# Altium project pcb_project.prjpcb (part 1 of 2)
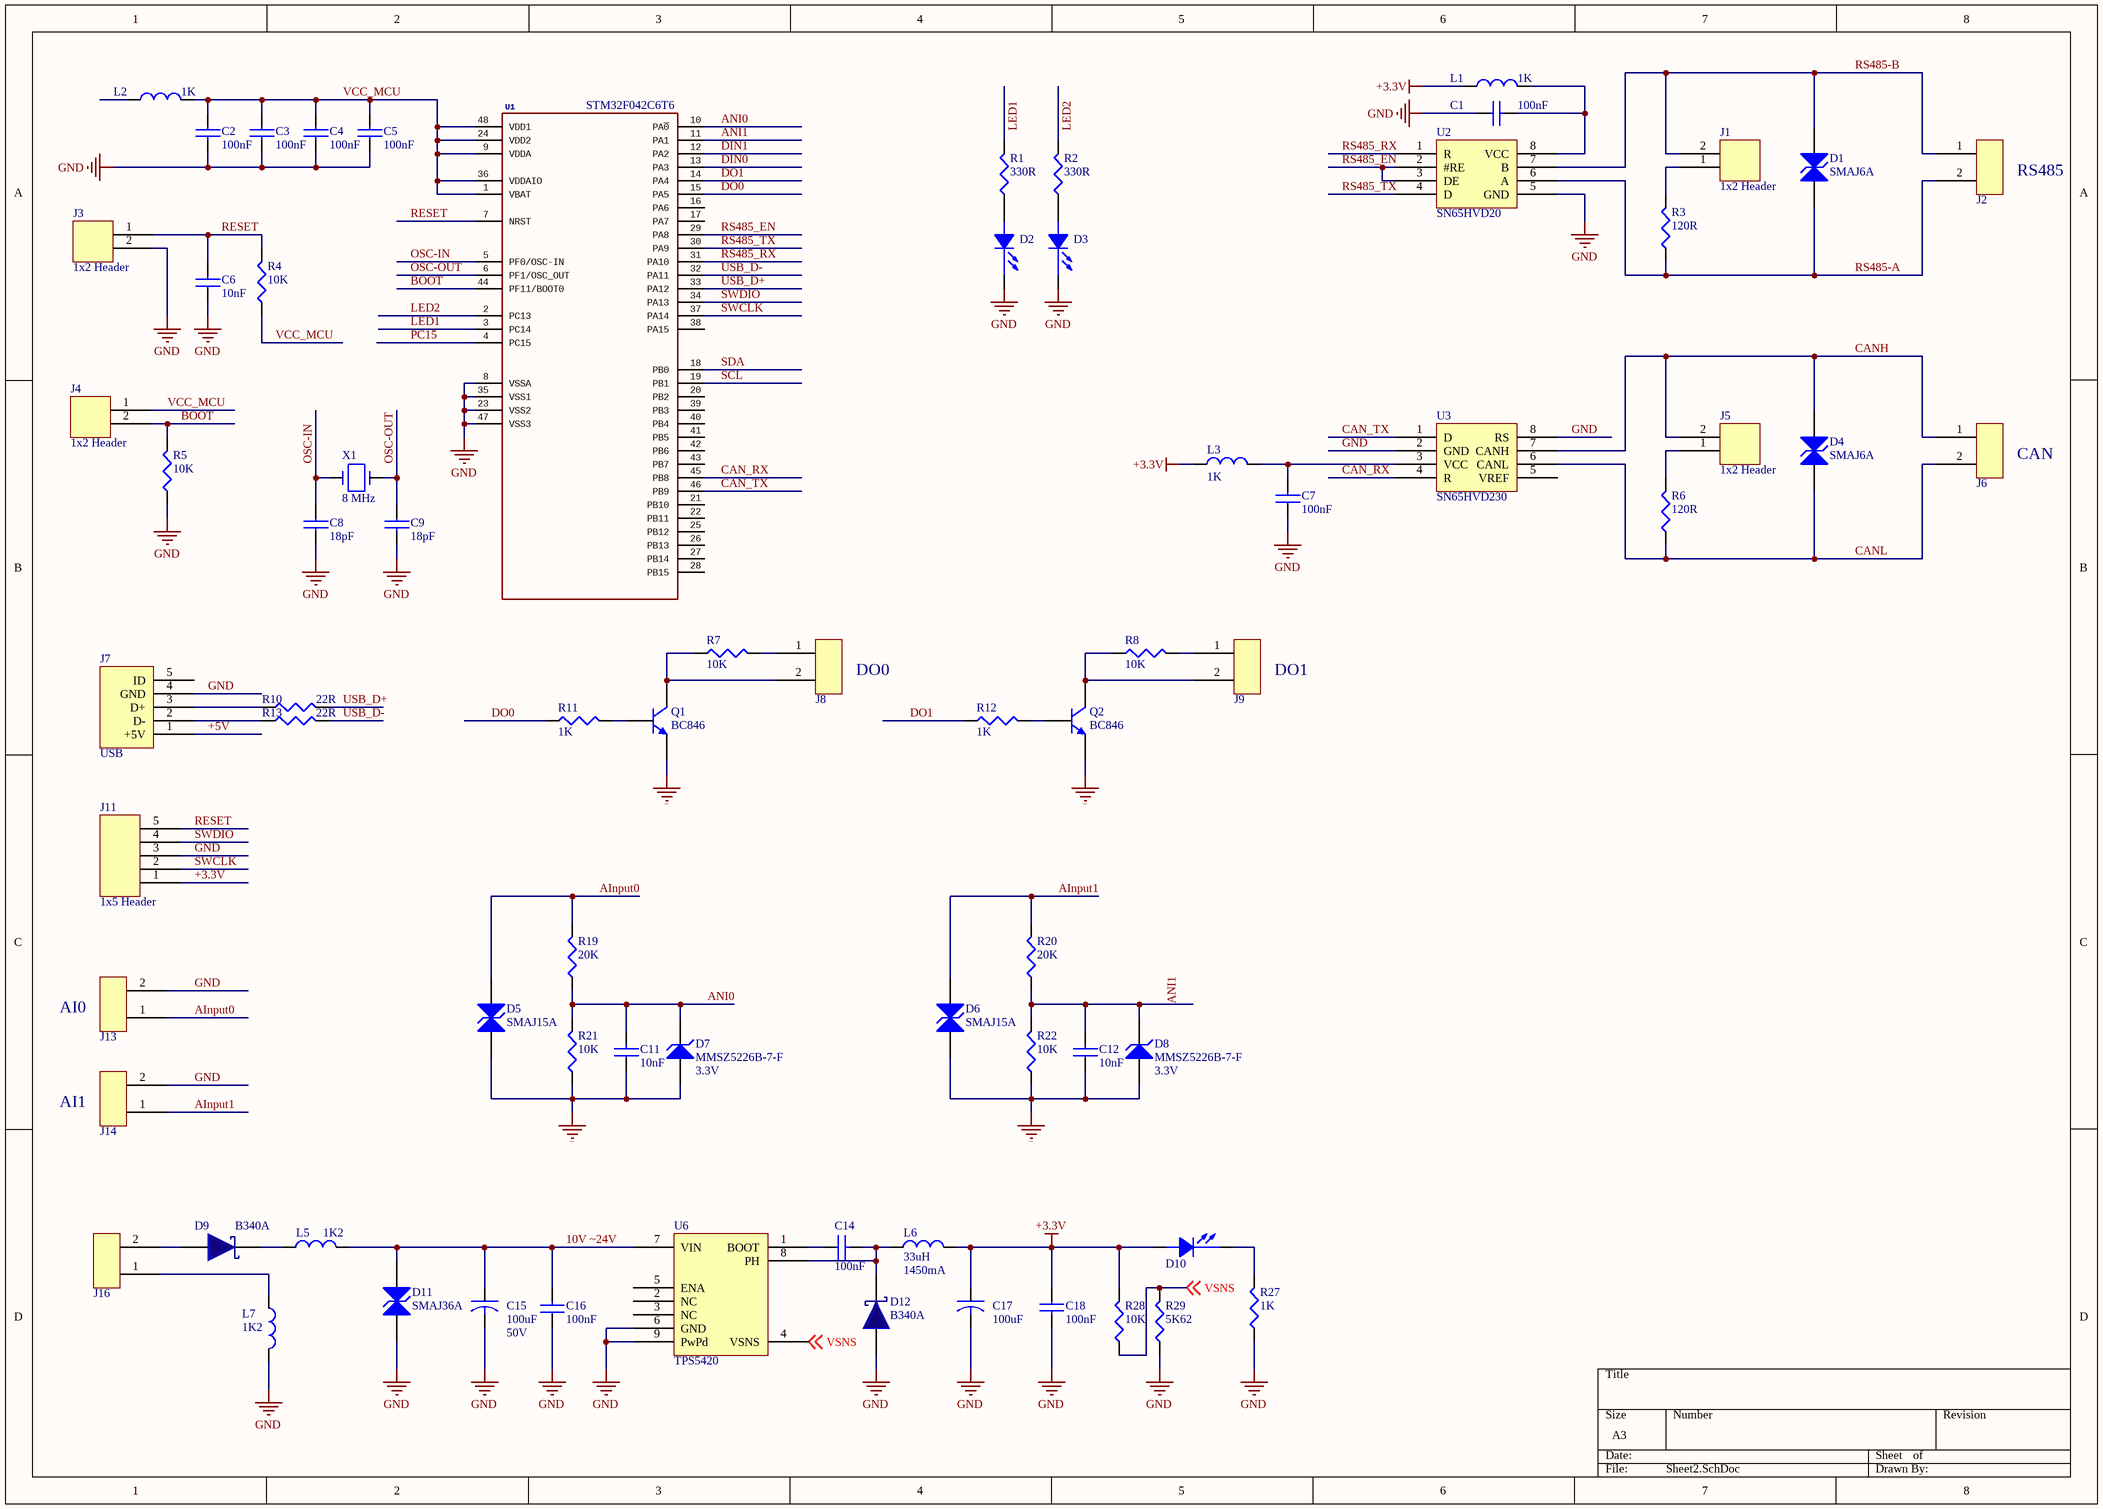
[diagram p0: Sheet2.SchDoc]
10 sheets, 305 parts. Net scope: flat (ports and power ports of the same name join across sheets).
Board file: PCB1.PcbDoc
Sheets:
  Sheet2.SchDoc
  Power.SchDoc
  opto_input.schdoc
  MCU.SchDoc
  Analog_Voltage_Outputs.SchDoc
  Analog Inputs.SchDoc
  Serial and Ethernet.SchDoc
  Resistive_Load_Output.SchDoc
  Analog_Current_Output.SchDoc
  Frequency_Output.SchDoc

## Sheet Sheet2.SchDoc
size A3; PageSetup: Record=PageOptions|CenterHorizontal=True|CenterVertical=True|PrintScale=1.00|XCorrection=1.00|YCorrection=1.00|PrintKind=1|BorderSize=5000000|LeftOffset=0|BottomOffset=0|Orientation=2|PaperLength=1000|PaperWidth=1000|Scale=100|PaperSource=7|PrintQuality=-3|MediaType=1|DitherType=10|PrintScaleMode=1|PaperKind=A3|PaperIndex=8

### Parts
(Parts that share a designator on the sheet are numbered #1, #2 ... from top to bottom, then left to right.)
C1  value 100nF  [0805 SMD Ceramic Capacitor]  (hidden comment: C0805C104)
C2  value 100nF  [0805 SMD Ceramic Capacitor]  (hidden comment: C0805C104)
C3  value 100nF  [0805 SMD Ceramic Capacitor]  (hidden comment: C0805C104)
C4  value 100nF  [0805 SMD Ceramic Capacitor]  (hidden comment: C0805C104)
C5  value 100nF  [0805 SMD Ceramic Capacitor]  (hidden comment: C0805C104)
C6  value 10nF  [0805 SMD Ceramic Capacitor]  (hidden comment: C0805C103)
C7  value 100nF  [0805 SMD Ceramic Capacitor]  (hidden comment: C0805C104)
C8  value 18pF  [0805 SMD Ceramic Capacitor]  (hidden comment: C0805C180)
C9  value 18pF  [0805 SMD Ceramic Capacitor]  (hidden comment: C0805C180)
C11  value 10nF  [0805 SMD Ceramic Capacitor]  (hidden comment: C0805C103)
C12  value 10nF  [0805 SMD Ceramic Capacitor]  (hidden comment: C0805C103)
C14  value 100nF  [0805 SMD Ceramic Capacitor]  (hidden comment: C0805C104)
C15  value 100uF  Voltage: 50V  [150CLZ1010]  (hidden comment: 100uF/50V Electrolitic)
C16  value 100nF  [0805 SMD Ceramic Capacitor]  (hidden comment: C0805C104)
C17  value 100uF  [D Case]  (hidden comment: T491D107)
C18  value 100nF  [0805 SMD Ceramic Capacitor]  (hidden comment: C0805C104)
D1  SMAJ6A  [SMA]
D2  LED  [1206]  (value not drawn)
D3  LED  [1206]  (value not drawn)
D4  SMAJ6A  [SMA]
D5  SMAJ15A  [SMA]
D6  SMAJ15A  [SMA]
D7  value 3.3V  [SOD-123]  (hidden comment: MMSZ5226B-7-F)
D8  value 3.3V  [SOD-123]  (hidden comment: MMSZ5226B-7-F)
D9  B340A  [SMB]
D10  LED  [1206]  (value not drawn)
D11  SMAJ36A  [SMA]
D12  B340A  [SMB]
J1  value 1x2 Header  [1x2 2 Pin Header]  (hidden comment: 1x2 2 Pin Header)
J2  2x Terminal  [2x Terminal mini]  (value not drawn)
J3  value 1x2 Header  [1x2 2 Pin Header]  (hidden comment: 1x2 2 Pin Header)
J4  value 1x2 Header  [1x2 2 Pin Header]  (hidden comment: 1x2 2 Pin Header)
J5  value 1x2 Header  [1x2 2 Pin Header]  (hidden comment: 1x2 2 Pin Header)
J6  2x Terminal  [2x Terminal mini]  (value not drawn)
J7  value USB  [Mini USB B]  (hidden comment: USB_B)
J8  2x Terminal  [2x Terminal mini]  (value not drawn)
J9  2x Terminal  [2x Terminal mini]  (value not drawn)
J11  value 1x5 Header  [1x5 5 Pin Header]  (hidden comment: 1x5 5 Pin Header)
J13  2x Terminal  [2x Terminal mini]  (value not drawn)
J14  2x Terminal  [2x Terminal mini]  (value not drawn)
J16  2x Terminal  [2x Terminal mini]  (value not drawn)
L1  value 1K  [0805 Inductor]  (hidden comment: 0805Ferrite)
L2  value 1K  [0805 Inductor]  (hidden comment: 0805Ferrite)
L3  value 1K  [0805 Inductor]  (hidden comment: 0805Ferrite)
L5  value 1K2  [1206 Inductor]  (hidden comment: 1206Ferrite)
L6  value 33uH  Current: 1450mA  [Power Inductor]  (hidden comment: 33uH_1450mA)
L7  value 1K2  [1206 Inductor]  (hidden comment: 1206Ferrite)
Q1  BC846  [SOT23]
Q2  BC846  [SOT23]
R1  value 330R  [0805 Resistor]  (hidden comment: 0805_330R)
R2  value 330R  [0805 Resistor]  (hidden comment: 0805_330R)
R3  value 120R  [0805 Resistor]  (hidden comment: 0805_120R)
R4  value 10K  [0805 Resistor]  (hidden comment: 0805_10K)
R5  value 10K  [0805 Resistor]  (hidden comment: 0805_10K)
R6  value 120R  [0805 Resistor]  (hidden comment: 0805_120R)
R7  value 10K  [0805 Resistor]  (hidden comment: 0805_10K)
R8  value 10K  [0805 Resistor]  (hidden comment: 0805_10K)
R10  value 22R  [0805 Resistor]  (hidden comment: 0805_22R%1)
R11#1  value 1K  [0805 Resistor]  (hidden comment: 0805_1K)
R12#1  value 1K  [0805 Resistor]  (hidden comment: 0805_1K)
R13#1  value 22R  [0805 Resistor]  (hidden comment: 0805_22R%1)
R19#1  value 20K  [0805 Resistor]  (hidden comment: 0805_20K)
R20#1  value 20K  [0805 Resistor]  (hidden comment: 0805_20K)
R21#1  value 10K  [0805 Resistor]  (hidden comment: 0805_10K)
R22#1  value 10K  [0805 Resistor]  (hidden comment: 0805_10K)
R27  value 1K  [0805 Resistor]  (hidden comment: 0805_1K)
R28  value 10K  [0805 Resistor]  (hidden comment: 0805_10K)
R29  value 5K62  [0805 Resistor]  (hidden comment: 0805_5K62%1)
U1  value STM32F042C6T6  [LQFP-48]  (hidden comment: *)
U2  SN65HVD20  [SO8]
U3  SN65HVD230  [SO8]
U6  TPS5420  [DDA8]
X1  value 8 MHz  [SMD Crystal]  (hidden comment: SMD XTAL 8MHz)

### Nets
+3.3V: C17.1 C18.1 D10.1(ANODE) J11.1 L1.1 L3.1 L6.2 R28.2
GND: C1.1 C2.2 C3.2 C4.2 C5.2 C6.1 C7.1 C8.2 C9.2 C11.1 C12.1 C15.2 C16.1 C17.2 C18.2 D2.2(CATHODE) D3.2(CATHODE) D5.1(A) D6.1(A) D7.2(A) D8.2(A) D11.1(A) D12.2 J3.2 J7.4(GND) J11.3 J13.2 J14.2 L7.2 Q1.2(E) Q2.2(E) R5.1 R21#1.1 R22#1.1 R27.1 R29.1 U1.8(VSSA) U1.23(VSS2) U1.35(VSS1) U1.47(VSS3) U2.5(GND) U3.2(GND) U3.8(RS) U6.6(GND) U6.9(PwPd)
10V ~24V: C15.1 C16.2 D11.2(K) L5.2 U6.7(VIN)
+5V: J7.1(+5V)
AInput0: D5.2(K) J13.1 R19#1.2
AInput1: D6.2(K) J14.1 R20#1.2
ANI0: C11.2 D7.1(K) R19#1.1 R21#1.2 U1.10(PA~{0})
ANI1: C12.2 D8.1(K) R20#1.1 R22#1.2 U1.11(PA1)
BOOT: J4.2 R5.2 U1.44(PF11/BOOT0)
CAN_RX: U1.45(PB8) U3.4(R)
CAN_TX: U1.46(PB9) U3.1(D)
CANH: D4.2(K) J5.2 J6.1 U3.7(CANH)
CANL: D4.1(A) J6.2 R6.1 U3.6(CANL)
DIN0: U1.13(PA3)
DIN1: U1.12(PA2)
DO0: R11#1.1 U1.15(PA5)
DO1: R12#1.1 U1.14(PA4)
LED1: R1.2 U1.3(PC14)
LED2: R2.2 U1.2(PC13)
OSC-IN: C8.1 U1.5(PF0/OSC-IN) X1.2
OSC-OUT: C9.1 U1.6(PF1/OSC_OUT) X1.1
PC15: U1.4(PC15)
RESET: C6.2 J3.1 J11.5 R4.2 U1.7(NRST)
RS485-A: D1.1(A) J2.2 R3.1 U2.6(A)
RS485-B: D1.2(K) J1.2 J2.1 U2.7(B)
RS485_EN: U1.29(PA8) U2.2(#RE) U2.3(DE)
RS485_RX: U1.31(PA10) U2.1(R)
RS485_TX: U1.30(PA9) U2.4(D)
SCL: U1.19(PB1)
SDA: U1.18(PB0)
SWCLK: J11.2 U1.37(PA14)
SWDIO: J11.4 U1.34(PA13)
USB_D+: R10.2 U1.33(PA12)
USB_D-: R13#1.2 U1.32(PA11)
VCC_MCU: C2.1 C3.1 C4.1 C5.1 J4.1 L2.2 R4.1 U1.1(VBAT) U1.9(VDDA) U1.24(VDD2) U1.36(VDDAIO) U1.48(VDD1)
VSNS: R28.1 R29.2 U6.4(VSNS) ; off-sheet VSNS
NetC1_2: C1.2 L1.2 U2.8(VCC)
NetC7_2: C7.2 L3.2 U3.3(VCC)
NetC14_1: C14.1 U6.1(BOOT)
NetC14_2: C14.2 D12.1 L6.1 U6.8(PH)
NetD2_1: D2.1(ANODE) R1.1
NetD3_1: D3.1(ANODE) R2.1
NetD9_1: D9.1 L5.1
NetD9_2: D9.2 J16.2
NetD10_2: D10.2(CATHODE) R27.2
NetJ1_1: J1.1 R3.2
NetJ5_1: J5.1 R6.2
NetJ7_2: J7.2(D-) R13#1.1
NetJ7_3: J7.3(D+) R10.1
NetJ8_1: J8.1 R7.2
NetJ8_2: J8.2 Q1.3(C) R7.1
NetJ9_1: J9.1 R8.2
NetJ9_2: J9.2 Q2.3(C) R8.1
NetJ16_1: J16.1 L7.1
NetQ1_1: Q1.1(B) R11#1.2
NetQ2_1: Q2.1(B) R12#1.2

Not connected (* = marked no-connect by the designer): J7 5(ID); L2 1; U1 16(PA6) 17(PA7) 20(PB2) 21(PB10) 22(PB11) 25(PB12) 26(PB13) 27(PB14) 28(PB15) 38(PA15) 39(PB3) 40(PB4) 41(PB5) 42(PB6) 43(PB7); U3 5(VREF); U6 2(NC) 3(NC) 5(ENA)

### Notes on the sheet
- (near J2) RS485
- (near J6) CAN
- (near J8) DO0
- (near J9) DO1
- (near J13) AI0
- (near J14) AI1

### Library data of the parts
C1-C5 C7 C14 C16 C18 = C0805C104: Manufacturer Code: C0805C104J5RACTU; Manufacturer: KEMET; Voltage: 50V; Farnell Code: 1414663; Unit Price: 0,06 €; Package: 0805
C6 C11 C12 = C0805C103: Manufacturer: KEMET; Manufacturer Code: C0805C103J3GACTU; Voltage: 25V; Temp. Coefficient: ±30ppm/°C; Tolerance: ±5%; Farnell Code: 1457736; Unit Price: 0,64 €; Package: 0805
C8 C9 = C0805C180: Manufacturer Code: C0805C180J5GACTU; Manufacturer: KEMET; Voltage: 50V; Farnell Code: 1414673; Unit Price: 0,038 €; Package: 0805
C15 = 100uF/50V Electrolitic: Manufacturer: Vishay; Manufacturer Code: 222215097101; Farnell Code: 1838778; Unit Price: 0,94 €
C17 = T491D107: Manufacturer Code: T491D107K010AT; Manufacturer: KEMET; Voltage: 10V; Farnell Code: 1457492; Unit Price: 0,47 €
D1 D4 = SMAJ6A: Manufacturer: MULTICOMP; Manufacturer Code: SMAJ6.0A; Voltage: 6V; Farnell Code: 1579007; Unit Price: 0,24 €; Value: SMAJ6A
D2 D3 D10 = LED: Manufacturer Code: LGN971; Manufacturer: OSRAM; Value: Green; Farnell Code: 1226371; Unit Price: 0,127 €
D5 D6 = SMAJ15A: Manufacturer: Littlefuse Inc.; Voltage: 12V; Manufacturer Code: SMAJ15A; Unit Price: 0,35$; Value: SMAJ15A
D7 D8 = MMSZ5226B-7-F: Manufacturer: Diodes Incorporated; Unit Price: 0.19$; Manufacturer Code: MMSZ5226B-7-F
D9 D12 = B340A: Manufacturer Code: B340A-13-F; Manufacturer: DIODES INC.; Voltage: 40V; Forward Current: 3A; Unit Price: 0,42$; Value: B340A
D11 = SMAJ36A: Manufacturer: Littlefuse Inc.; Voltage: 12V; Manufacturer Code: SMAJ36A; Unit Price: 0,38$; Value: SMAJ36A
J2 J6 J8 J9 J13 J14 J16 = 2x Terminal: Manufacturer: WEIDMULLER; Manufacturer Code: PM5.08/2/90 BLK; Value: 2x Terminal; Farnell Code: 1131855; Unit Price: 0,55 €
J7 = USB_B: Manufacturer: MULTICOMP; Manufacturer Code: MC32598; Farnell Code: 1696539; Unit Price: 1,07 €
L1-L3 = 0805Ferrite: Manufacturer Code: MMZ2012R102A; Manufacturer: TDK; Current: 500mA; Farnell Code: 1669719; Unit Price: 0,059 €
L5 L7 = 1206Ferrite: Manufacturer Code: MLB-321611-1200PL; Manufacturer: MEC MARCOM; Current: 1A; Farnell Code: 1308794; Unit Price: 0,30 €
L6 = 33uH_1450mA: Manufacturer: Murata Power Solutions; Manufacturer Code: 46333C; Unit Price: 0,67; Farnell Code: 2062833
Q1 Q2 = BC846: Manufacturer: NXP Semiconductors; Voltage: 65V; Farnell Code: 1081227; Manufacturer Code: BC846; Unit Price: 0,049 €; Value: BC846
R1 R2 = 0805_330R: Manufacturer Code: MC 0.1W 0805 1% 330R; Manufacturer: MULTICOMP; Tolerance: ±1%; Farnell Code: 9333037; Unit Price: 0,03 €
R3 R6 = 0805_120R: Manufacturer Code: MC 0.1W 0805 1% 120R; Manufacturer: MULTICOMP; Tolerance: ±1%; Farnell Code: 9332480; Unit Price: 0,03 €
R4 R5 R7 R8 R21#1 R22#1 R28 = 0805_10K: Manufacturer Code: MC 0.1W 0805 1% 10K; Manufacturer: MULTICOMP; Tolerance: ±1%; Farnell Code: 9332391; Unit Price: 0,03 €
R10 R13#1 = 0805_22R%1: Manufacturer Code: MC01W0805122R; Manufacturer: MULTICOMP; Tolerance: ±1%; Farnell Code: 9332847; Unit Price: 0,02 €; MOQ: 10
R11#1 R12#1 R27 = 0805_1K: Manufacturer Code: MC01W080511K; Manufacturer: MULTICOMP; Tolerance: ±1%; Farnell Code: 9332383; Unit Price: 0,03 €
R19#1 R20#1 = 0805_20K: Manufacturer Code: MC 0.1W 0805 1% 20K; Manufacturer: MULTICOMP; Tolerance: ±1%; Farnell Code: 9332774; Unit Price: 0,03 €
R29 = 0805_5K62%1: Manufacturer Code: CRCW08055K62FKEA; Manufacturer: VISHAY DRALORIC; Tolerance: ±1%; Farnell Code: 1469942; Unit Price: 0,018 €
U1 = STM32F042C6T6: Manufacturer: ST Microelectronics; Unit Price: 2,94$; Manufacturer Code: STM32F042C6T6; DeviceSetName: STM32F042C6T6
U2 = SN65HVD20: Manufacturer: Texas Instruments; Manufacturer Code: SN65HVD20D; Unit Price: 3,56 €; Farnell Code: 1212361; Value: SN65HVD20
U3 = SN65HVD230: Manufacturer: Texas Instruments; Manufacturer Code: SN65HVD230D; Unit Price: 2,77$; Value: SN65HVD230
U6 = TPS5420: Manufacturer: Texas Instruments; Manufacturer Code: TPS5420DG4; Farnell Code: 1262365; Unit Price: 4,99 €; Value: TPS5420
X1 = SMD XTAL 8MHz: Manufacturer: Abracon LLC; Manufacturer Code: ABLS-8.000MHZ-B4-T; Frequency Stability: ±50ppm; Frequency Tolerance: ±30ppm; Load Capacitance: 18pF; Operating Mode: Fundamental; Supplier 1: Digi-Key; RoHS: RoHS Compliant; Category: Crystals, Oscillators, Resonators; Stock 1: 24477; Pricing 1: 1=0.25, 10=0.209, 50=0.1882, 100=0.1672, 500=0.15884 (USD); Packaging: Cut Tape (CT); Part Status: Active; Type: MHz Crystal; Operating Temperature: -20°C ~ 70°C; Ratings: -; Mounting Type: Surface Mount; Package / Case: HC-49/US; Size / Dimension: 0.449" L x 0.185" W (11.40mm x 4.70mm); Height - Seated (Max): 0.165" (4.20mm); ComponentLink1URL: https://abracon.com/Resonators/abls.pdf; ComponentLink1Description: https://abracon.com/Resonators/abls.pdf; Supplier Part Number 1: 535-10212-1-ND; Unit Price: 0,25$

## Sheet Power.SchDoc
size A3
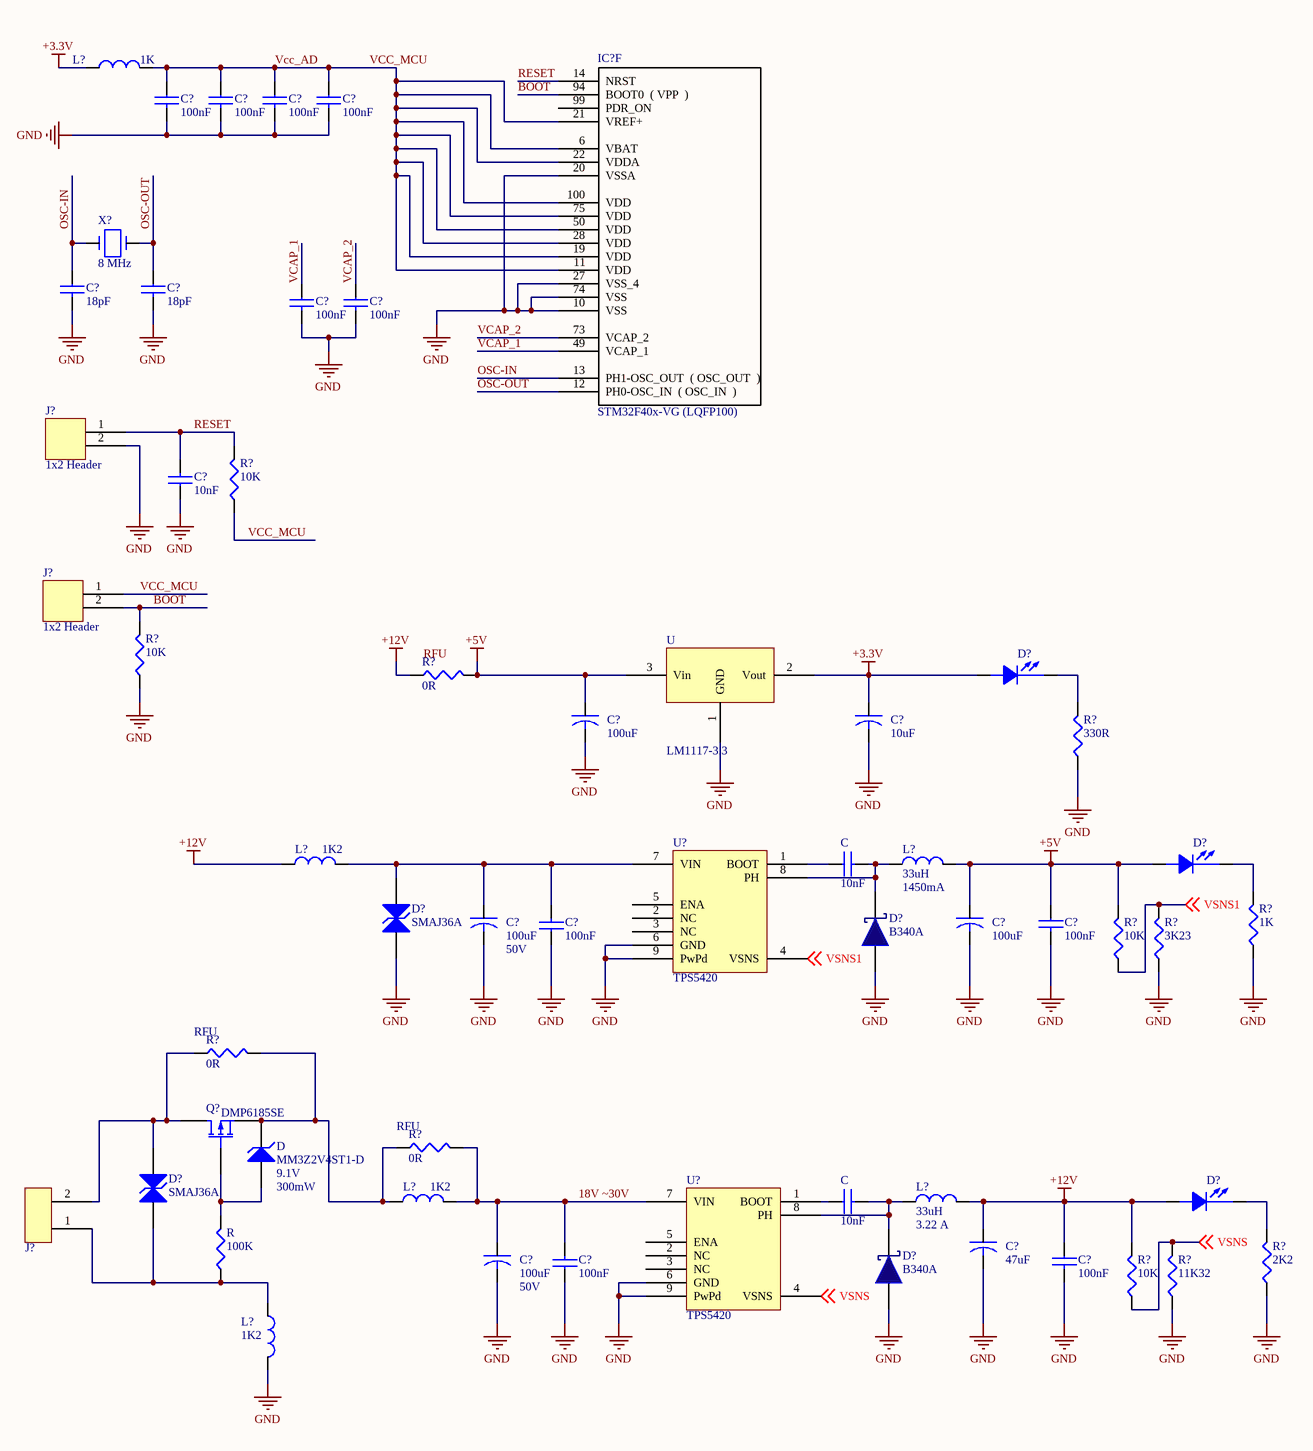
[diagram p1: Power.SchDoc]

### Parts
(Parts that share a designator on the sheet are numbered #1, #2 ... from top to bottom, then left to right.)
C#1  value 10nF  [0402 SMD Ceramic Capacitor]  (hidden comment: 0402_10nF)
C#2  value 10nF  [0402 SMD Ceramic Capacitor]  (hidden comment: 0402_10nF)
C?#1  value 100nF  [0805 SMD Ceramic Capacitor]  (hidden comment: C0805C104)
C?#2  value 100nF  [0805 SMD Ceramic Capacitor]  (hidden comment: C0805C104)
C?#3  value 100nF  [0805 SMD Ceramic Capacitor]  (hidden comment: C0805C104)
C?#4  value 100nF  [0805 SMD Ceramic Capacitor]  (hidden comment: C0805C104)
C?#5  value 18pF  [0805 SMD Ceramic Capacitor]  (hidden comment: C0805C180)
C?#6  value 18pF  [0805 SMD Ceramic Capacitor]  (hidden comment: C0805C180)
C?#7  value 100nF  [0805 SMD Ceramic Capacitor]  (hidden comment: C0805C104)
C?#8  value 100nF  [0805 SMD Ceramic Capacitor]  (hidden comment: C0805C104)
C?#9  value 10nF  [0805 SMD Ceramic Capacitor]  (hidden comment: C0805C103)
C?#10  value 100uF  [D Case]  (hidden comment: T491D107)
C?#11  value 10uF  [A Case]  (hidden comment: T491A106)
C?#12  value 100uF  Voltage: 50V  [150CLZ1010]  (hidden comment: 100uF/50V Electrolitic)
C?#13  value 100uF  [D Case]  (hidden comment: T491D107)
C?#14  value 100nF  [0805 SMD Ceramic Capacitor]  (hidden comment: C0805C104)
C?#15  value 100nF  [0805 SMD Ceramic Capacitor]  (hidden comment: C0805C104)
C?#16  value 47uF  [D Case]  (hidden comment: T491D107)
C?#17  value 100uF  Voltage: 50V  [150CLZ1010]  (hidden comment: 100uF/50V Electrolitic)
C?#18  value 100nF  [0805 SMD Ceramic Capacitor]  (hidden comment: C0805C104)
C?#19  value 100nF  [0805 SMD Ceramic Capacitor]  (hidden comment: C0805C104)
D  Voltage: 9.1V  Power: 300mW  [SOD128]  (hidden comment: MM3Z2V4ST1-D)
D?#1  LED  [1206]  (value not drawn)
D?#2  LED  [1206]  (value not drawn)
D?#3  SMAJ36A  [SMA]
D?#4  B340A  [SMB]
D?#5  SMAJ36A  [SMA]
D?#6  LED  [1206]  (value not drawn)
D?#7  B340A  [SMB]
IC?#1  STM32F40x-VG (LQFP100)  [LQFP100]  (part F of 6)
J?#1  value 1x2 Header  [1x2 2 Pin Header]  (hidden comment: 1x2 2 Pin Header)
J?#2  value 1x2 Header  [1x2 2 Pin Header]  (hidden comment: 1x2 2 Pin Header)
J?#3  2x Terminal  [2x Terminal mini]  (value not drawn)
L?#1  value 1K  [0805 Inductor]  (hidden comment: 0805Ferrite)
L?#2  value 1K2  [1206 Inductor]  (hidden comment: 1206Ferrite)
L?#3  value 33uH  Current: 1450mA  [Power Inductor]  (hidden comment: 33uH_1450mA)
L?#4  value 1K2  [1206 Inductor]  (hidden comment: 1206Ferrite)
L?#5  value 33uH  Current: 3.22 A  [Power Inductor]  (hidden comment: 33uH_1450mA)
L?#6  value 1K2  [1206 Inductor]  (hidden comment: 1206Ferrite)
Q?#1  value DMP6185SE  [SOT223]  (hidden comment: Si2302DS)
R  value 100K  [0402 Resistor]  (hidden comment: 0402_100K%1)
R?#1  value 10K  [0805 Resistor]  (hidden comment: 0805_10K)
R?#2  value 0R  [0402 Resistor]  (hidden comment: 0402_0R%1)
R?#3  value 10K  [0805 Resistor]  (hidden comment: 0805_10K)
R?#4  value 330R  [0805 Resistor]  (hidden comment: 0805_330R)
R?#5  value 1K  [0805 Resistor]  (hidden comment: 0805_1K)
R?#6  value 10K  [0805 Resistor]  (hidden comment: 0805_10K)
R?#7  value 3K23  [0805 Resistor]  (hidden comment: 0805_5K62%1)
R?#8  value 0R  Usage: RFU  [0402 Resistor]  (hidden comment: 0402_0R%1)
R?#9  value 0R  Usage: RFU  [0402 Resistor]  (hidden comment: 0402_0R%1)
R?#10  value 2K2  [0805 Resistor]  (hidden comment: 0805_1K)
R?#11  value 10K  [0805 Resistor]  (hidden comment: 0805_10K)
R?#12  value 11K32  [0805 Resistor]  (hidden comment: 0805_5K62%1)
U  LM1117-3.3  [SOT223]
U?#1  TPS5420  [DDA8]
U?#2  TPS5420  [DDA8]
X?  value 8 MHz  [SMD Crystal]  (hidden comment: SMD XTAL 8MHz)

### Nets
+3.3V: C?#11.1 D?#1.1(ANODE) L?#1.1 U.2(Vout)
+5V: C?#10.1 C?#13.1 C?#14.1 D?#2.1(ANODE) L?#3.2 R?#2.2 R?#6.2 U.3(Vin)
+12V: C?#16.1 C?#18.1 D?#6.1(ANODE) L?#2.1 L?#5.2 R?#2.1 R?#11.2
GND: C?#1.2 C?#2.2 C?#3.2 C?#4.2 C?#5.2 C?#6.2 C?#7.2 C?#8.2 C?#9.1 C?#10.2 C?#11.2 C?#12.2 C?#13.2 C?#14.2 C?#15.1 C?#16.2 C?#17.2 C?#18.2 C?#19.1 D?#3.1(A) D?#4.2 D?#7.2 IC?#1.10(VSS) IC?#1.20(VSSA) IC?#1.27(VSS_4) IC?#1.74(VSS) J?#1.2 L?#6.2 R?#3.1 R?#4.1 R?#5.1 R?#7.1 R?#10.1 R?#12.1 U.1(GND) U?#1.6(GND) U?#1.9(PwPd) U?#2.6(GND) U?#2.9(PwPd)
18V ~30V: C?#17.1 C?#19.2 L?#4.2 R?#9.2 U?#2.7(VIN)
BOOT: IC?#1.94(BOOT0__(_VPP__)) J?#2.2 R?#3.2
OSC-IN: C?#5.1 IC?#1.13(PH1-OSC_OUT__(_OSC_OUT__)) X?.2
OSC-OUT: C?#6.1 IC?#1.12(PH0-OSC_IN__(_OSC_IN__)) X?.1
RESET: C?#9.2 IC?#1.14(NRST) J?#1.1 R?#1.2
VCAP_1: C?#7.1 IC?#1.49(VCAP_1)
VCAP_2: C?#8.1 IC?#1.73(VCAP_2)
Vcc_AD: C?#1.1 C?#2.1 C?#3.1 C?#4.1 IC?#1.6(VBAT) IC?#1.11(VDD) IC?#1.19(VDD) IC?#1.21(VREF+) IC?#1.22(VDDA) IC?#1.28(VDD) IC?#1.50(VDD) IC?#1.75(VDD) IC?#1.100(VDD) J?#2.1 L?#1.2 R?#1.1  [also labelled VCC_MCU]
VSNS: R?#11.1 R?#12.2 U?#2.4(VSNS) ; off-sheet VSNS
VSNS1: R?#6.1 R?#7.2 U?#1.4(VSNS) ; off-sheet VSNS1
NetC#1_1: C#1.1 U?#1.1(BOOT)
NetC#1_2: C#1.2 D?#4.1 L?#3.1 U?#1.8(PH)
NetC#2_1: C#2.1 U?#2.1(BOOT)
NetC#2_2: C#2.2 D?#7.1 L?#5.1 U?#2.8(PH)
NetC?#12_1: C?#12.1 C?#15.2 D?#3.2(K) L?#2.2 U?#1.7(VIN)
NetD?#1_2: D?#1.2(CATHODE) R?#4.2
NetD?#2_2: D?#2.2(CATHODE) R?#5.2
NetD?#5_1: D?#5.1(A) J?#3.1 L?#6.1 R.1
NetD?#5_2: D?#5.2(K) J?#3.2 Q?#1.3(D) R?#8.1
NetD?#6_2: D?#6.2(CATHODE) R?#10.2
NetD_1: D.1(A) Q?#1.1(G) R.2
NetD_2: D.2(K) L?#4.1 Q?#1.2(S) R?#8.2 R?#9.1

Not connected (* = marked no-connect by the designer): IC?#1 99(PDR_ON); U 4(GND); U?#1 2(NC) 3(NC) 5(ENA); U?#2 2(NC) 3(NC) 5(ENA)

### Notes on the sheet
- Labels drawn without touching a wire or pin: RFU

### Library data of the parts
C#1 C#2 = 0402_10nF: Manufacturer: MURATA; Manufacturer Code: GRM155R71C103KA01D; Tolerance: ±10%; Voltage: 25V; Dielectric Characteristic: X7R; Unit Price: 0,014 €; Farnell Code: 8819734; MOQ: 10; Package: 0402
C?#1-C?#4 C?#7 C?#8 C?#14 C?#15 C?#18 C?#19 = C0805C104: as C1 on sheet Sheet2; Farnell Code: 1414663; Unit Price: 0,06 €; Package: 0805
C?#5 C?#6 = C0805C180: as C8 on sheet Sheet2; Farnell Code: 1414673; Unit Price: 0,038 €; Package: 0805
C?#9 = C0805C103: as C6 on sheet Sheet2; Farnell Code: 1457736; Unit Price: 0,64 €; Package: 0805
C?#10 C?#13 = T491D107: as C17 on sheet Sheet2; Farnell Code: 1457492; Unit Price: 0,47 €
C?#11 = T491A106: Manufacturer Code: T491A106K006AT; Manufacturer: KEMET; Voltage: 6V3; Farnell Code: 1457412; Unit Price: 0,143 €
C?#12 C?#17 = 100uF/50V Electrolitic: as C15 on sheet Sheet2; Farnell Code: 1838778; Unit Price: 0,94 €
C?#16 = T491D107: Manufacturer Code: TCNT476M016R0200A; Manufacturer: AVX Corporation; Voltage: 16V; Unit Price: 0,78 €; Digikey Part Number: 478-9595-1-ND
D = MM3Z2V4ST1-D: Manufacturer: ON Semiconductor; Manufacturer Code: MM3Z2V4ST1-D; Unit Price: 0,34 €; Value: MM3Z2V4ST1-D
D?#1 D?#2 D?#6 = LED: as D2 on sheet Sheet2; Farnell Code: 1226371; Unit Price: 0,127 €
D?#3 D?#5 = SMAJ36A: as D11 on sheet Sheet2; Manufacturer Code: SMAJ36A; Unit Price: 0,38$; Value: SMAJ36A
D?#4 D?#7 = B340A: as D9 on sheet Sheet2; Unit Price: 0,42$; Value: B340A
IC?#1 = STM32F40x-VG
J?#3 = 2x Terminal: as J2 on sheet Sheet2; Value: 2x Terminal; Farnell Code: 1131855; Unit Price: 0,55 €
L?#1 = 0805Ferrite: as L1 on sheet Sheet2; Farnell Code: 1669719; Unit Price: 0,059 €
L?#2 L?#4 L?#6 = 1206Ferrite: as L5 on sheet Sheet2; Farnell Code: 1308794; Unit Price: 0,30 €
L?#3 = 33uH_1450mA: as L6 on sheet Sheet2; Unit Price: 0,67; Farnell Code: 2062833
L?#5 = 33uH_1450mA: Manufacturer: COILCRAFT; Manufacturer Code: MSS1260-333MLD; Unit Price: 2,81; Farnell Code: 2288431
Q?#1 = Si2302DS: Manufacturer: DIODES Incorporated; Voltage (Vds): 60V; Current (Id): 3000mA; Voltage (Vgs): -4,5V -  -10V; Manufacturer Code: DMP6185SE; Farnell Code: DMP6185SE-13DICT-ND; Unit Price: 0,48 €
R = 0402_100K%1: Manufacturer: VISHAY DRALORIC; Manufacturer Code: CRCW0402100KFKEAHP; Tolerance: ±1%; Temperature Coefficient: ±100ppm/K; Power Rating: 125mW; Farnell Code: 1738877; Unit Price: 0,031 €
R?#1 R?#3 R?#6 R?#11 = 0805_10K: as R4 on sheet Sheet2; Farnell Code: 9332391; Unit Price: 0,03 €
R?#2 R?#8 R?#9 = 0402_0R%1: Manufacturer: VISHAY DRALORIC; Manufacturer Code: CRCW04020000Z0ED; Tolerance: ±1%; Temperature Coefficient: ±100ppm/°C; Power Rating: 125mW; Farnell Code: 1469661; Unit Price: 0,027 €
R?#4 = 0805_330R: as R1 on sheet Sheet2; Farnell Code: 9333037; Unit Price: 0,03 €
R?#5 R?#10 = 0805_1K: as R11#1 on sheet Sheet2; Farnell Code: 9332383; Unit Price: 0,03 €
R?#7 R?#12 = 0805_5K62%1: as R29 on sheet Sheet2; Farnell Code: 1469942; Unit Price: 0,018 €
U = LM1117-3.3: Manufacturer: Texas Instruments; Manufacturer Code: LM1117MP-3.3; Current: 800mA; Voltage: 3.3V; Unit Price: 1,14 €; Farnell Code: 9778195; Value: LM1117-3.3
U?#1 U?#2 = TPS5420: as U6 on sheet Sheet2; Farnell Code: 1262365; Unit Price: 4,99 €; Value: TPS5420
X? = SMD XTAL 8MHz: as X1 on sheet Sheet2; Supplier 1: Digi-Key; RoHS: RoHS Compliant; Category: Crystals, Oscillators, Resonators; Stock 1: 24477; Pricing 1: 1=0.25, 10=0.209, 50=0.1882, 100=0.1672, 500=0.15884 (USD); Packaging: Cut Tape (CT); Part Status: Active; Type: MHz Crystal; Operating Temperature: -20°C ~ 70°C; Ratings: -; Mounting Type: Surface Mount; Package / Case: HC-49/US; Size / Dimension: 0.449" L x 0.185" W (11.40mm x 4.70mm); Height - Seated (Max): 0.165" (4.20mm); ComponentLink1URL: https://abracon.com/Resonators/abls.pdf; ComponentLink1Description: https://abracon.com/Resonators/abls.pdf; Supplier Part Number 1: 535-10212-1-ND; Unit Price: 0,25$

## Sheet opto_input.schdoc
size A4
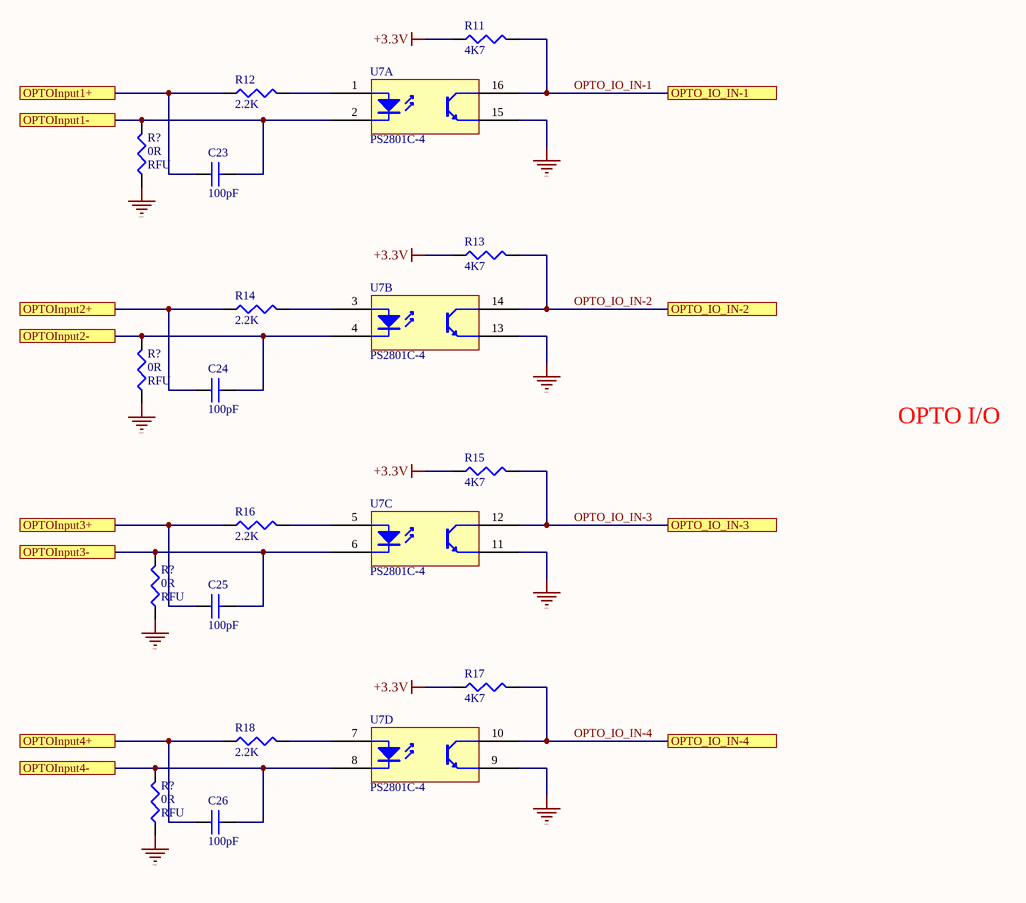
[diagram p2: opto_input.schdoc]

### Parts
(Parts that share a designator on the sheet are numbered #1, #2 ... from top to bottom, then left to right.)
C23  value 100pF  [0805 SMD Ceramic Capacitor]  (hidden comment: C0805C101)
C24  value 100pF  [0805 SMD Ceramic Capacitor]  (hidden comment: C0805C101)
C25  value 100pF  [0805 SMD Ceramic Capacitor]  (hidden comment: C0805C101)
C26  value 100pF  [0805 SMD Ceramic Capacitor]  (hidden comment: C0805C101)
R11#2  value 4K7  [0805 Resistor]  (hidden comment: 0805_4K7%1)
R12#2  value 2.2K  [0805 Resistor]  (hidden comment: 0805_1K)
R13#2  value 4K7  [0805 Resistor]  (hidden comment: 0805_4K7%1)
R14  value 2.2K  [0805 Resistor]  (hidden comment: 0805_1K)
R15  value 4K7  [0805 Resistor]  (hidden comment: 0805_4K7%1)
R16  value 2.2K  [0805 Resistor]  (hidden comment: 0805_1K)
R17  value 4K7  [0805 Resistor]  (hidden comment: 0805_4K7%1)
R18  value 2.2K  [0805 Resistor]  (hidden comment: 0805_1K)
R?#13  value 0R  Usage: RFU  [0402 Resistor]  (hidden comment: 0402_0R%1)
R?#14  value 0R  Usage: RFU  [0402 Resistor]  (hidden comment: 0402_0R%1)
R?#15  value 0R  Usage: RFU  [0402 Resistor]  (hidden comment: 0402_0R%1)
R?#16  value 0R  Usage: RFU  [0402 Resistor]  (hidden comment: 0402_0R%1)
U7  value PS2801C-4  [SO16]  (hidden comment: PS2801C-4_Discrete)  (parts A,B,C,D of 4)

### Ports
OPTO_IO_IN-1, OPTO_IO_IN-2, OPTO_IO_IN-3, OPTO_IO_IN-4, OPTOInput1+, OPTOInput1-, OPTOInput2+, OPTOInput2-, OPTOInput3+, OPTOInput3-, OPTOInput4+, OPTOInput4-

### Nets
+3.3V: R11#2.1 R13#2.1 R15.1 R17.1
GND: R?#13.1 R?#14.1 R?#15.1 R?#16.1 U7.9 U7.11 U7.13 U7.15
OPTO_IO_IN-1: R11#2.2 U7.16 ; port OPTO_IO_IN-1
OPTO_IO_IN-2: R13#2.2 U7.14 ; port OPTO_IO_IN-2
OPTO_IO_IN-3: R15.2 U7.12 ; port OPTO_IO_IN-3
OPTO_IO_IN-4: R17.2 U7.10 ; port OPTO_IO_IN-4
NetC23_1: C23.1 R12#2.1 ; port OPTOInput1+
NetC23_2: C23.2 R?#13.2 U7.2 ; port OPTOInput1-
NetC24_1: C24.1 R14.1 ; port OPTOInput2+
NetC24_2: C24.2 R?#14.2 U7.4 ; port OPTOInput2-
NetC25_1: C25.1 R16.1 ; port OPTOInput3+
NetC25_2: C25.2 R?#15.2 U7.6 ; port OPTOInput3-
NetC26_1: C26.1 R18.1 ; port OPTOInput4+
NetC26_2: C26.2 R?#16.2 U7.8 ; port OPTOInput4-
NetR12#2_2: R12#2.2 U7.1
NetR14_2: R14.2 U7.3
NetR16_2: R16.2 U7.5
NetR18_2: R18.2 U7.7

### Notes on the sheet
- OPTO I/O

### Library data of the parts
C23-C26 = C0805C101: Manufacturer: MURATA Electronics; Manufacturer Code: GRM21A5C2E101JW01D; Voltage: 250V; Tolerance: ±5%; Unit Price: 0,33 $; Package: 0805
R11#2 R13#2 R15 R17 = 0805_4K7%1: Manufacturer Code: PCF0805P-R-4K7-BT1; Manufacturer: WELWYN; Tolerance: ±0.1%; Temperature Coefficient: ±25ppm/°C; Power Rating: 100mW; Unit Price: 0,34; Farnell Code: 1506096; MOQ: 5
R12#2 R14 R16 R18 = 0805_1K: as R11#1 on sheet Sheet2; Farnell Code: 9332383; Unit Price: 0,03 €
R?#13-R?#16 = 0402_0R%1: as R?#2 on sheet Power; Farnell Code: 1469661; Unit Price: 0,027 €
U7 = PS2801C-4_Discrete: Manufacturer Code: PS2801C-4-F3-A; Manufacturer: NEC; Input Current: 5mA; Farnell Code: 1682862; Unit Price: 1,37 €

## Sheet MCU.SchDoc
size A3; Organization: Altium Limited; Address1: L3, 12a Rodborough Rd; Address2: Frenchs Forest; Address3: NSW; Address4: Australia 2086
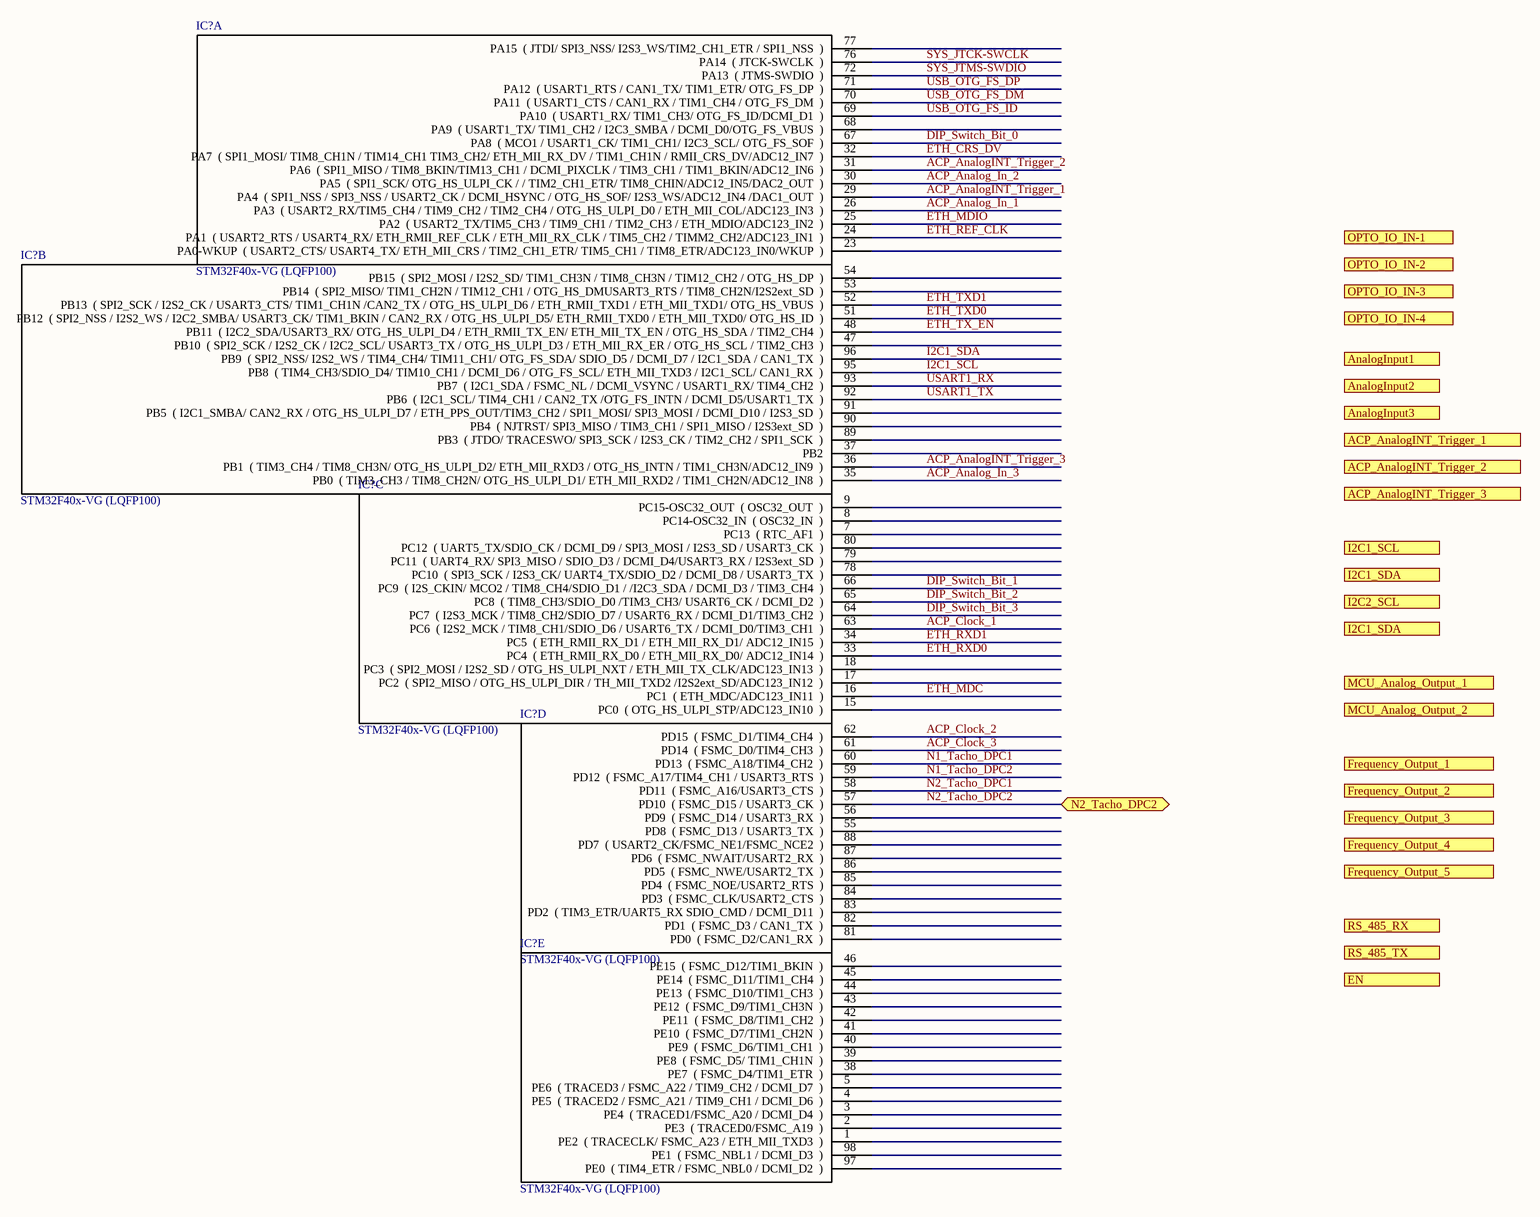
[diagram p3: MCU.SchDoc]

### Parts
(Parts that share a designator on the sheet are numbered #1, #2 ... from top to bottom, then left to right.)
IC?#2  STM32F40x-VG (LQFP100)  [LQFP100]  (part A of 6)
IC?#3  STM32F40x-VG (LQFP100)  [LQFP100]  (part B of 6)
IC?#4  STM32F40x-VG (LQFP100)  [LQFP100]  (part C of 6)
IC?#5  STM32F40x-VG (LQFP100)  [LQFP100]  (part D of 6)
IC?#6  STM32F40x-VG (LQFP100)  [LQFP100]  (part E of 6)

### Ports
ACP_AnalogINT_Trigger_1, ACP_AnalogINT_Trigger_2, ACP_AnalogINT_Trigger_3, AnalogInput1, AnalogInput2, AnalogInput3, EN, Frequency_Output_1, Frequency_Output_2, Frequency_Output_3, Frequency_Output_4, Frequency_Output_5, I2C1_SCL, I2C1_SDA, I2C2_SCL, MCU_Analog_Output_1, MCU_Analog_Output_2, N2_Tacho_DPC2 (bidir), OPTO_IO_IN-1, OPTO_IO_IN-2, OPTO_IO_IN-3, OPTO_IO_IN-4, RS_485_RX, RS_485_TX

### Nets
ACP_Analog_In_1: IC?#2.26(PA3__(_USART2_RX/TIM5_CH4_/_TIM9_CH2_/_TIM2_CH4_/_OTG_HS_ULPI_D0_/_ETH_MII_COL/ADC123_IN3__))
ACP_Analog_In_2: IC?#2.30(PA5__(_SPI1_SCK/_OTG_HS_ULPI_CK_/_/_TIM2_CH1_ETR/_TIM8_CHIN/ADC12_IN5/DAC2_OUT__))
ACP_Analog_In_3: IC?#3.35(PB0__(_TIM3_CH3_/_TIM8_CH2N/_OTG_HS_ULPI_D1/_ETH_MII_RXD2_/_TIM1_CH2N/ADC12_IN8__))
ACP_AnalogINT_Trigger_1: IC?#2.29(PA4__(_SPI1_NSS_/_SPI3_NSS_/_USART2_CK_/_DCMI_HSYNC_/_OTG_HS_SOF/_I2S3_WS/ADC12_IN4_/DAC1_OUT__))
ACP_AnalogINT_Trigger_2: IC?#2.31(PA6__(_SPI1_MISO_/_TIM8_BKIN/TIM13_CH1_/_DCMI_PIXCLK_/_TIM3_CH1_/_TIM1_BKIN/ADC12_IN6__))
ACP_AnalogINT_Trigger_3: IC?#3.36(PB1__(_TIM3_CH4_/_TIM8_CH3N/_OTG_HS_ULPI_D2/_ETH_MII_RXD3_/_OTG_HS_INTN_/_TIM1_CH3N/ADC12_IN9__))
ACP_Clock_1: IC?#4.63(PC6__(_I2S2_MCK_/_TIM8_CH1/SDIO_D6_/_USART6_TX_/_DCMI_D0/TIM3_CH1__))
ACP_Clock_2: IC?#5.62(PD15__(_FSMC_D1/TIM4_CH4__))
ACP_Clock_3: IC?#5.61(PD14__(_FSMC_D0/TIM4_CH3__))
DIP_Switch_Bit_0: IC?#2.67(PA8__(_MCO1_/_USART1_CK/_TIM1_CH1/_I2C3_SCL/_OTG_FS_SOF__))
DIP_Switch_Bit_1: IC?#4.66(PC9__(_I2S_CKIN/_MCO2_/_TIM8_CH4/SDIO_D1_/_/I2C3_SDA_/_DCMI_D3_/_TIM3_CH4__))
DIP_Switch_Bit_2: IC?#4.65(PC8__(_TIM8_CH3/SDIO_D0_/TIM3_CH3/_USART6_CK_/_DCMI_D2__))
DIP_Switch_Bit_3: IC?#4.64(PC7__(_I2S3_MCK_/_TIM8_CH2/SDIO_D7_/_USART6_RX_/_DCMI_D1/TIM3_CH2__))
ETH_CRS_DV: IC?#2.32(PA7__(_SPI1_MOSI/_TIM8_CH1N_/_TIM14_CH1_TIM3_CH2/_ETH_MII_RX_DV_/_TIM1_CH1N_/_RMII_CRS_DV/ADC12_IN7__))
ETH_MDC: IC?#4.16(PC1__(_ETH_MDC/ADC123_IN11__))
ETH_MDIO: IC?#2.25(PA2__(_USART2_TX/TIM5_CH3_/_TIM9_CH1_/_TIM2_CH3_/_ETH_MDIO/ADC123_IN2__))
ETH_REF_CLK: IC?#2.24(PA1__(_USART2_RTS_/_USART4_RX/_ETH_RMII_REF_CLK_/_ETH_MII_RX_CLK_/_TIM5_CH2_/_TIMM2_CH2/ADC123_IN1__))
ETH_RXD0: IC?#4.33(PC4__(_ETH_RMII_RX_D0_/_ETH_MII_RX_D0/_ADC12_IN14__))
ETH_RXD1: IC?#4.34(PC5__(_ETH_RMII_RX_D1_/_ETH_MII_RX_D1/_ADC12_IN15__))
ETH_TX_EN: IC?#3.48(PB11__(_I2C2_SDA/USART3_RX/_OTG_HS_ULPI_D4_/_ETH_RMII_TX_EN/_ETH_MII_TX_EN_/_OTG_HS_SDA_/_TIM2_CH4__))
ETH_TXD0: IC?#3.51(PB12__(_SPI2_NSS_/_I2S2_WS_/_I2C2_SMBA/_USART3_CK/_TIM1_BKIN_/_CAN2_RX_/_OTG_HS_ULPI_D5/_ETH_RMII_TXD0_/_ETH_MII_TXD0/_OTG_HS_ID__))
ETH_TXD1: IC?#3.52(PB13__(_SPI2_SCK_/_I2S2_CK_/_USART3_CTS/_TIM1_CH1N_/CAN2_TX_/_OTG_HS_ULPI_D6_/_ETH_RMII_TXD1_/_ETH_MII_TXD1/_OTG_HS_VBUS__))
I2C1_SCL: IC?#3.95(PB8__(_TIM4_CH3/SDIO_D4/_TIM10_CH1_/_DCMI_D6_/_OTG_FS_SCL/_ETH_MII_TXD3_/_I2C1_SCL/_CAN1_RX__))
I2C1_SDA: IC?#3.96(PB9__(_SPI2_NSS/_I2S2_WS_/_TIM4_CH4/_TIM11_CH1/_OTG_FS_SDA/_SDIO_D5_/_DCMI_D7_/_I2C1_SDA_/_CAN1_TX__))
N1_Tacho_DPC1: IC?#5.60(PD13__(_FSMC_A18/TIM4_CH2__))
N1_Tacho_DPC2: IC?#5.59(PD12__(_FSMC_A17/TIM4_CH1_/_USART3_RTS__))
N2_Tacho_DPC1: IC?#5.58(PD11__(_FSMC_A16/USART3_CTS__))
N2_Tacho_DPC2: IC?#5.57(PD10__(_FSMC_D15_/_USART3_CK__)) ; port N2_Tacho_DPC2
SYS_JTCK-SWCLK: IC?#2.76(PA14__(_JTCK-SWCLK__))
SYS_JTMS-SWDIO: IC?#2.72(PA13__(_JTMS-SWDIO__))
USART1_RX: IC?#3.93(PB7__(_I2C1_SDA_/_FSMC_NL_/_DCMI_VSYNC_/_USART1_RX/_TIM4_CH2__))
USART1_TX: IC?#3.92(PB6__(_I2C1_SCL/_TIM4_CH1_/_CAN2_TX_/OTG_FS_INTN_/_DCMI_D5/USART1_TX__))
USB_OTG_FS_DM: IC?#2.70(PA11__(_USART1_CTS_/_CAN1_RX_/_TIM1_CH4_/_OTG_FS_DM__))
USB_OTG_FS_DP: IC?#2.71(PA12__(_USART1_RTS_/_CAN1_TX/_TIM1_ETR/_OTG_FS_DP__))
USB_OTG_FS_ID: IC?#2.69(PA10__(_USART1_RX/_TIM1_CH3/_OTG_FS_ID/DCMI_D1__))

Not connected (* = marked no-connect by the designer): IC?#2 23(PA0-WKUP__(_USART2_CTS/_USART4_TX/_ETH_MII_CRS_/_TIM2_CH1_ETR/_TIM5_CH1_/_TIM8_ETR/ADC123_IN0/WKUP__)) 68(PA9__(_USART1_TX/_TIM1_CH2_/_I2C3_SMBA_/_DCMI_D0/OTG_FS_VBUS__)) 77(PA15__(_JTDI/_SPI3_NSS/_I2S3_WS/TIM2_CH1_ETR_/_SPI1_NSS__)); IC?#3 37(PB2) 47(PB10__(_SPI2_SCK_/_I2S2_CK_/_I2C2_SCL/_USART3_TX_/_OTG_HS_ULPI_D3_/_ETH_MII_RX_ER_/_OTG_HS_SCL_/_TIM2_CH3__)) 53(PB14__(_SPI2_MISO/_TIM1_CH2N_/_TIM12_CH1_/_OTG_HS_DMUSART3_RTS_/_TIM8_CH2N/I2S2ext_SD__)) 54(PB15__(_SPI2_MOSI_/_I2S2_SD/_TIM1_CH3N_/_TIM8_CH3N_/_TIM12_CH2_/_OTG_HS_DP__)) 89(PB3__(_JTDO/_TRACESWO/_SPI3_SCK_/_I2S3_CK_/_TIM2_CH2_/_SPI1_SCK__)) 90(PB4__(_NJTRST/_SPI3_MISO_/_TIM3_CH1_/_SPI1_MISO_/_I2S3ext_SD__)) 91(PB5__(_I2C1_SMBA/_CAN2_RX_/_OTG_HS_ULPI_D7_/_ETH_PPS_OUT/TIM3_CH2_/_SPI1_MOSI/_SPI3_MOSI_/_DCMI_D10_/_I2S3_SD__)); IC?#4 7(PC13__(_RTC_AF1__)) 8(PC14-OSC32_IN__(_OSC32_IN__)) 9(PC15-OSC32_OUT__(_OSC32_OUT__)) 15(PC0__(_OTG_HS_ULPI_STP/ADC123_IN10__)) 17(PC2__(_SPI2_MISO_/_OTG_HS_ULPI_DIR_/_TH_MII_TXD2_/I2S2ext_SD/ADC123_IN12__)) 18(PC3__(_SPI2_MOSI_/_I2S2_SD_/_OTG_HS_ULPI_NXT_/_ETH_MII_TX_CLK/ADC123_IN13__)) 78(PC10__(_SPI3_SCK_/_I2S3_CK/_UART4_TX/SDIO_D2_/_DCMI_D8_/_USART3_TX__)) 79(PC11__(_UART4_RX/_SPI3_MISO_/_SDIO_D3_/_DCMI_D4/USART3_RX_/_I2S3ext_SD__)) 80(PC12__(_UART5_TX/SDIO_CK_/_DCMI_D9_/_SPI3_MOSI_/_I2S3_SD_/_USART3_CK__)); IC?#5 55(PD8__(_FSMC_D13_/_USART3_TX__)) 56(PD9__(_FSMC_D14_/_USART3_RX__)) 81(PD0__(_FSMC_D2/CAN1_RX__)) 82(PD1__(_FSMC_D3_/_CAN1_TX__)) 83(PD2__(_TIM3_ETR/UART5_RX_SDIO_CMD_/_DCMI_D11__)) 84(PD3__(_FSMC_CLK/USART2_CTS__)) 85(PD4__(_FSMC_NOE/USART2_RTS__)) 86(PD5__(_FSMC_NWE/USART2_TX__)) 87(PD6__(_FSMC_NWAIT/USART2_RX__)) 88(PD7__(_USART2_CK/FSMC_NE1/FSMC_NCE2__)); IC?#6 1(PE2__(_TRACECLK/_FSMC_A23_/_ETH_MII_TXD3__)) 2(PE3__(_TRACED0/FSMC_A19__)) 3(PE4__(_TRACED1/FSMC_A20_/_DCMI_D4__)) 4(PE5__(_TRACED2_/_FSMC_A21_/_TIM9_CH1_/_DCMI_D6__)) 5(PE6__(_TRACED3_/_FSMC_A22_/_TIM9_CH2_/_DCMI_D7__)) 38(PE7__(_FSMC_D4/TIM1_ETR__)) 39(PE8__(_FSMC_D5/_TIM1_CH1N__)) 40(PE9__(_FSMC_D6/TIM1_CH1__)) 41(PE10__(_FSMC_D7/TIM1_CH2N__)) 42(PE11__(_FSMC_D8/TIM1_CH2__)) 43(PE12__(_FSMC_D9/TIM1_CH3N__)) 44(PE13__(_FSMC_D10/TIM1_CH3__)) 45(PE14__(_FSMC_D11/TIM1_CH4__)) 46(PE15__(_FSMC_D12/TIM1_BKIN__)) 97(PE0__(_TIM4_ETR_/_FSMC_NBL0_/_DCMI_D2__)) 98(PE1__(_FSMC_NBL1_/_DCMI_D3__))

### Notes on the sheet
- Title
- Size:
- Date:
- A3
- Number:
- Time:
- Revision:
- Sheet
- of
- File:

### Library data of the parts
IC?#2-IC?#6 = STM32F40x-VG

## Sheet Analog_Voltage_Outputs.SchDoc
size A3; Organization: Altium Limited; Address1: L3, 12a Rodborough Rd; Address2: Frenchs Forest; Address3: NSW; Address4: Australia 2086
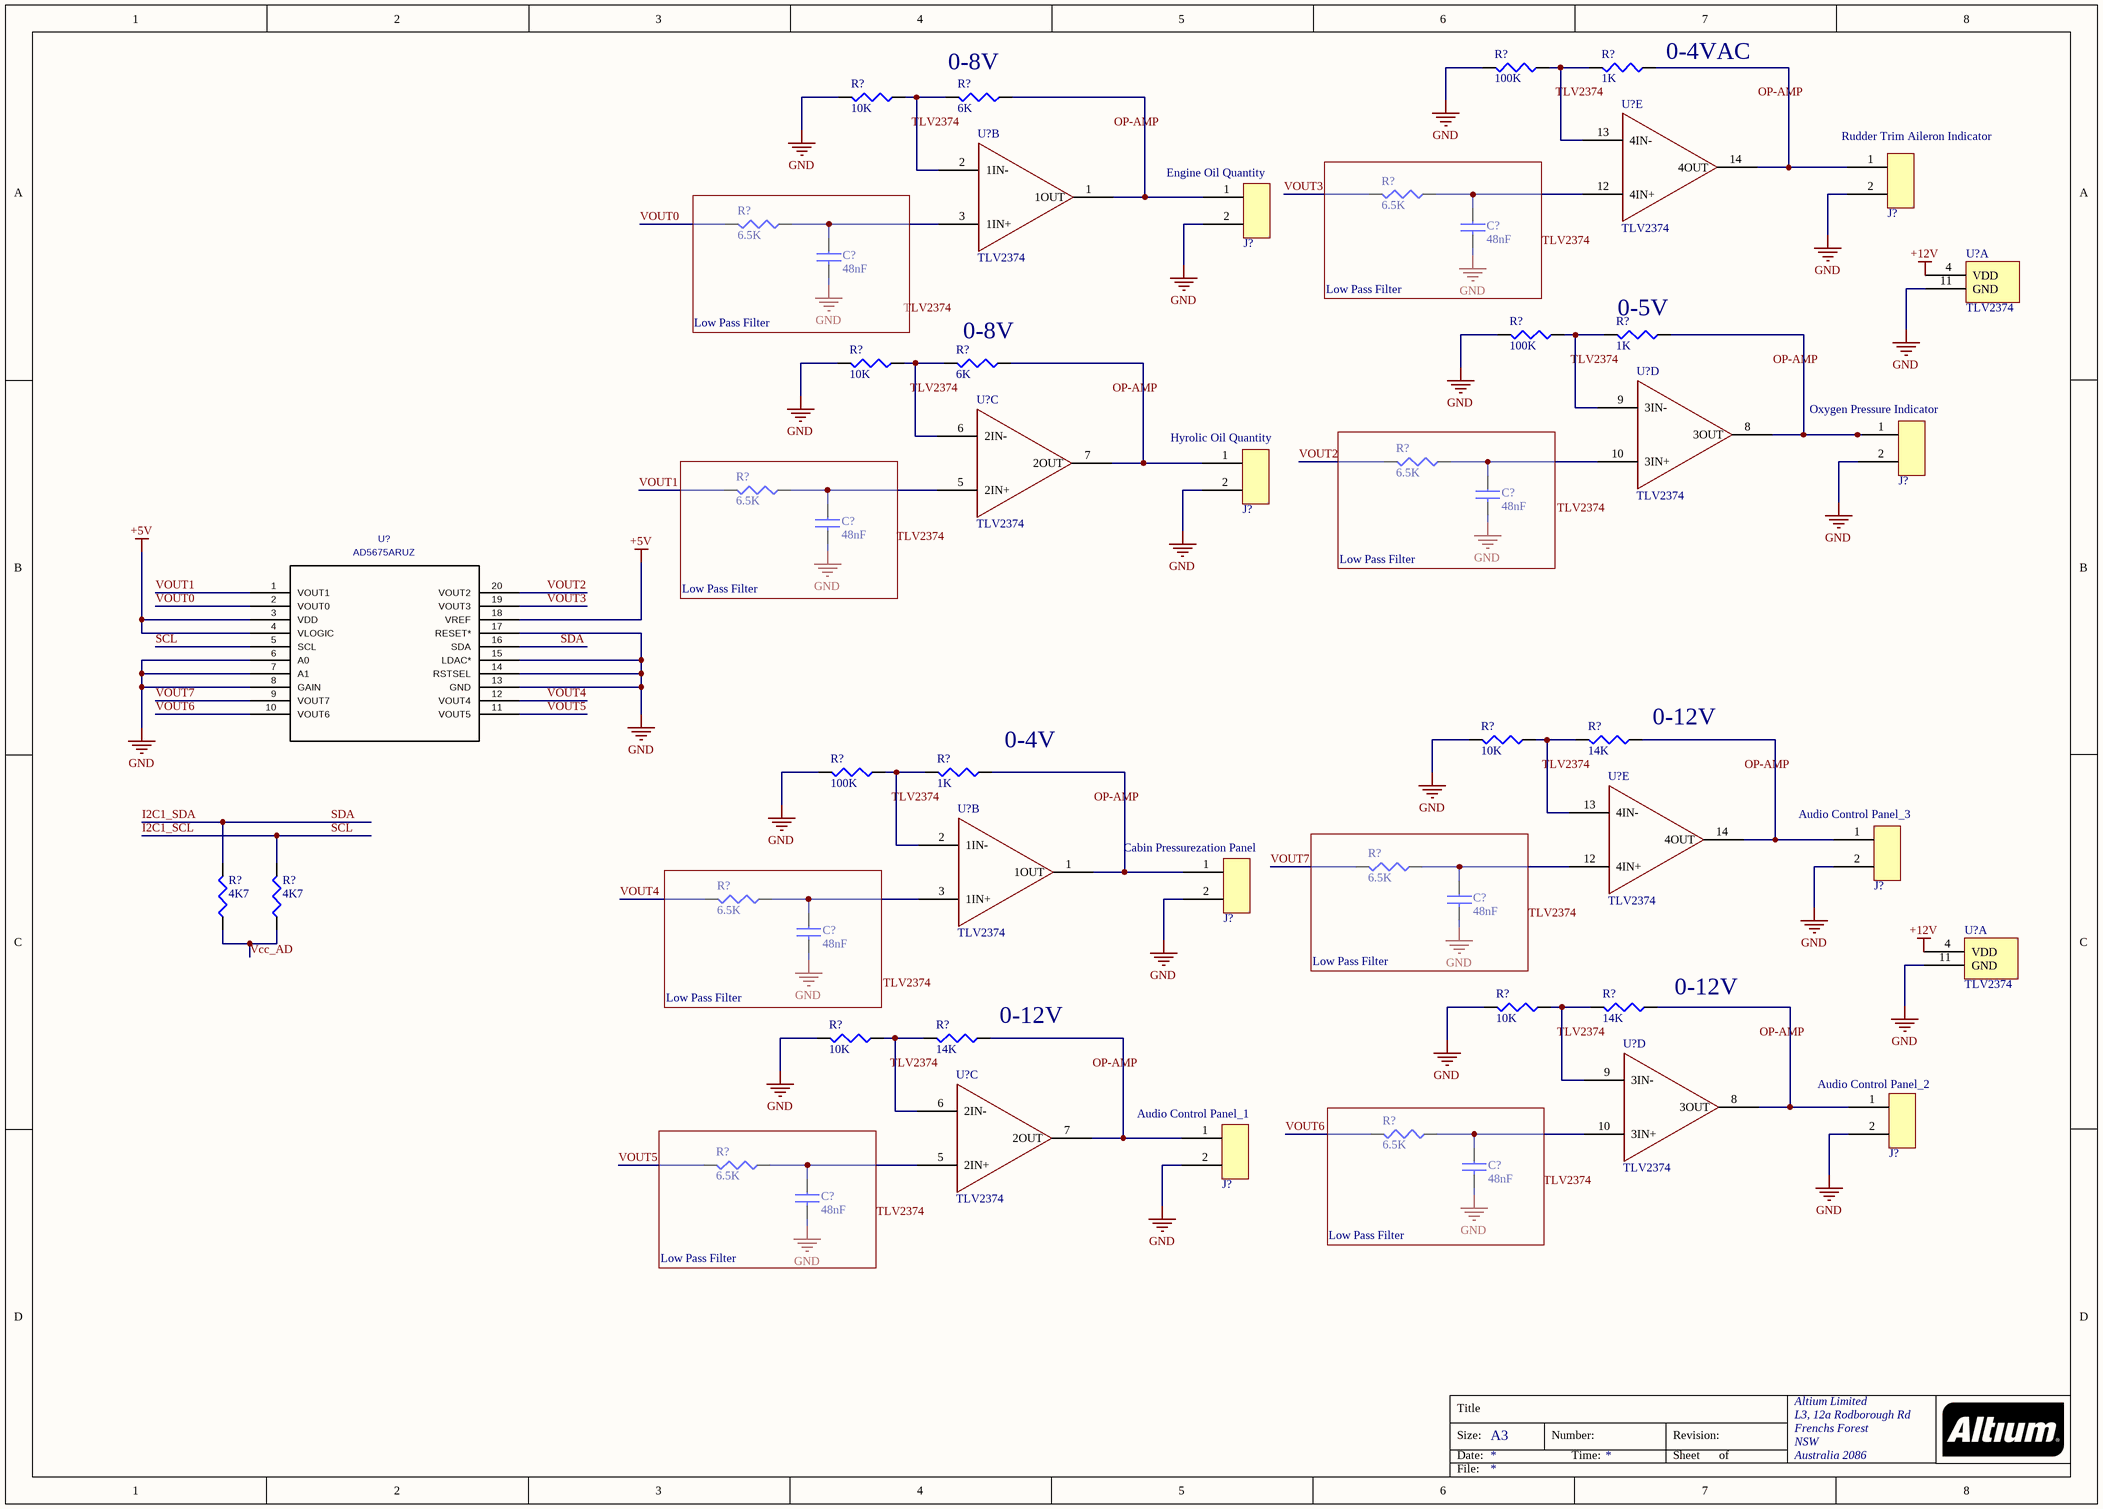
[diagram p4: Analog_Voltage_Outputs.SchDoc]

### Parts
(Parts that share a designator on the sheet are numbered #1, #2 ... from top to bottom, then left to right.)
C?#20  value 48nF  [0805 SMD Ceramic Capacitor]  (hidden comment: C0805C333)
C?#21  value 48nF  [0805 SMD Ceramic Capacitor]  (hidden comment: C0805C333)
C?#22  value 48nF  [0805 SMD Ceramic Capacitor]  (hidden comment: C0805C333)
C?#23  value 48nF  [0805 SMD Ceramic Capacitor]  (hidden comment: C0805C333)
C?#24  value 48nF  [0805 SMD Ceramic Capacitor]  (hidden comment: C0805C333)
C?#25  value 48nF  [0805 SMD Ceramic Capacitor]  (hidden comment: C0805C333)
C?#26  value 48nF  [0805 SMD Ceramic Capacitor]  (hidden comment: C0805C333)
C?#27  value 48nF  [0805 SMD Ceramic Capacitor]  (hidden comment: C0805C333)
J?#4  2x Terminal  [2x Terminal mini]  (value not drawn)
J?#5  2x Terminal  [2x Terminal mini]  (value not drawn)
J?#6  2x Terminal  [2x Terminal mini]  (value not drawn)
J?#7  2x Terminal  [2x Terminal mini]  (value not drawn)
J?#8  2x Terminal  [2x Terminal mini]  (value not drawn)
J?#9  2x Terminal  [2x Terminal mini]  (value not drawn)
J?#10  2x Terminal  [2x Terminal mini]  (value not drawn)
J?#11  2x Terminal  [2x Terminal mini]  (value not drawn)
R?#17  value 100K  [0805 Resistor]  (hidden comment: 0805_1K)
R?#18  value 1K  [0805 Resistor]  (hidden comment: 0805_1K)
R?#19  value 10K  [0805 Resistor]  (hidden comment: 0805_1K)
R?#20  value 6K  [0805 Resistor]  (hidden comment: 0805_1K)
R?#21  value 6.5K  [0805 Resistor]  (hidden comment: 0805_1K)
R?#22  value 6.5K  [0805 Resistor]  (hidden comment: 0805_1K)
R?#23  value 100K  [0805 Resistor]  (hidden comment: 0805_1K)
R?#24  value 1K  [0805 Resistor]  (hidden comment: 0805_1K)
R?#25  value 10K  [0805 Resistor]  (hidden comment: 0805_1K)
R?#26  value 6K  [0805 Resistor]  (hidden comment: 0805_1K)
R?#27  value 6.5K  [0805 Resistor]  (hidden comment: 0805_1K)
R?#28  value 6.5K  [0805 Resistor]  (hidden comment: 0805_1K)
R?#29  value 10K  [0805 Resistor]  (hidden comment: 0805_1K)
R?#30  value 14K  [0805 Resistor]  (hidden comment: 0805_1K)
R?#31  value 100K  [0805 Resistor]  (hidden comment: 0805_1K)
R?#32  value 1K  [0805 Resistor]  (hidden comment: 0805_1K)
R?#33  value 6.5K  [0805 Resistor]  (hidden comment: 0805_1K)
R?#34  value 6.5K  [0805 Resistor]  (hidden comment: 0805_1K)
R?#35  value 4K7  [0805 Resistor]  (hidden comment: 0805_4K7%1)
R?#36  value 4K7  [0805 Resistor]  (hidden comment: 0805_4K7%1)
R?#37  value 10K  [0805 Resistor]  (hidden comment: 0805_1K)
R?#38  value 14K  [0805 Resistor]  (hidden comment: 0805_1K)
R?#39  value 10K  [0805 Resistor]  (hidden comment: 0805_1K)
R?#40  value 14K  [0805 Resistor]  (hidden comment: 0805_1K)
R?#41  value 6.5K  [0805 Resistor]  (hidden comment: 0805_1K)
R?#42  value 6.5K  [0805 Resistor]  (hidden comment: 0805_1K)
U?#3  TLV2374  [SO14]  (part E of 5)
U?#4  TLV2374  [SO14]  (part B of 5)
U?#5  TLV2374  [SO14]  (part A of 5)
U?#6  TLV2374  [SO14]  (part D of 5)
U?#7  TLV2374  [SO14]  (part C of 5)
U?#8  AD5675ARUZ  [RU_20]
U?#9  TLV2374  [SO14]  (part E of 5)
U?#10  TLV2374  [SO14]  (part B of 5)
U?#11  TLV2374  [SO14]  (part A of 5)
U?#12  TLV2374  [SO14]  (part D of 5)
U?#13  TLV2374  [SO14]  (part C of 5)

### Blocks framed on the sheet
Low Pass Filter: C?#20 R?#21
Low Pass Filter: C?#21 R?#22
Low Pass Filter: C?#22 R?#27
Low Pass Filter: C?#23 R?#28
Low Pass Filter: C?#25 R?#34
Low Pass Filter: C?#24 R?#33
Low Pass Filter: C?#27 R?#42
Low Pass Filter: C?#26 R?#41

### Nets
+5V: U?#8.3(VDD) U?#8.4(VLOGIC) U?#8.18(VREF)
+12V: U?#5.4(VDD) U?#11.4(VDD)
GND: C?#20.2 C?#21.2 C?#22.2 C?#23.2 C?#24.2 C?#25.2 C?#26.2 C?#27.2 J?#4.2 J?#5.2 J?#6.2 J?#7.2 J?#8.2 J?#9.2 J?#10.2 J?#11.2 R?#17.2 R?#19.2 R?#23.2 R?#25.2 R?#29.2 R?#31.2 R?#37.2 R?#39.2 U?#5.11(GND) U?#8.6(A0) U?#8.7(A1) U?#8.8(GAIN) U?#8.13(GND) U?#8.14(RSTSEL) U?#8.15(LDAC*) U?#8.17(RESET*) U?#11.11(GND)
I2C1_SCL: R?#36.2 U?#8.5(SCL)  [also labelled SCL]
I2C1_SDA: R?#35.2 U?#8.16(SDA)  [also labelled SDA]
Vcc_AD: R?#35.1 R?#36.1
VOUT0: R?#22.2 U?#8.2(VOUT0)
VOUT1: R?#28.2 U?#8.1(VOUT1)
VOUT2: R?#27.2 U?#8.20(VOUT2)
VOUT3: R?#21.2 U?#8.19(VOUT3)
VOUT4: R?#34.2 U?#8.12(VOUT4)
VOUT5: R?#42.2 U?#8.11(VOUT5)
VOUT6: R?#41.2 U?#8.10(VOUT6)
VOUT7: R?#33.2 U?#8.9(VOUT7)
NetC?#20_1: C?#20.1 R?#21.1 U?#3.12(4IN+)
NetC?#21_1: C?#21.1 R?#22.1 U?#4.3(1IN+)
NetC?#22_1: C?#22.1 R?#27.1 U?#6.10(3IN+)
NetC?#23_1: C?#23.1 R?#28.1 U?#7.5(2IN+)
NetC?#24_1: C?#24.1 R?#33.1 U?#9.12(4IN+)
NetC?#25_1: C?#25.1 R?#34.1 U?#10.3(1IN+)
NetC?#26_1: C?#26.1 R?#41.1 U?#12.10(3IN+)
NetC?#27_1: C?#27.1 R?#42.1 U?#13.5(2IN+)
NetJ?#4_1: J?#4.1 R?#18.1 U?#3.14(4OUT)
NetJ?#5_1: J?#5.1 R?#20.1 U?#4.1(1OUT)
NetJ?#6_1: J?#6.1 R?#24.1 U?#6.8(3OUT)
NetJ?#7_1: J?#7.1 R?#26.1 U?#7.7(2OUT)
NetJ?#8_1: J?#8.1 R?#30.1 U?#9.14(4OUT)
NetJ?#9_1: J?#9.1 R?#32.1 U?#10.1(1OUT)
NetJ?#10_1: J?#10.1 R?#38.1 U?#12.8(3OUT)
NetJ?#11_1: J?#11.1 R?#40.1 U?#13.7(2OUT)
NetR?#17_1: R?#17.1 R?#18.2 U?#3.13(4IN-)
NetR?#19_1: R?#19.1 R?#20.2 U?#4.2(1IN-)
NetR?#23_1: R?#23.1 R?#24.2 U?#6.9(3IN-)
NetR?#25_1: R?#25.1 R?#26.2 U?#7.6(2IN-)
NetR?#29_1: R?#29.1 R?#30.2 U?#9.13(4IN-)
NetR?#31_1: R?#31.1 R?#32.2 U?#10.2(1IN-)
NetR?#37_1: R?#37.1 R?#38.2 U?#12.9(3IN-)
NetR?#39_1: R?#39.1 R?#40.2 U?#13.6(2IN-)

### Notes on the sheet
- (near R?#20) 0-8V
- (near R?#18) 0-4VAC
- (near J?#5) Engine Oil Quantity
- (near J?#4) Rudder Trim Aileron Indicator
- (near R?#24) 0-5V
- (near R?#26) 0-8V
- (near J?#7) Hyrolic Oil Quantity
- (near J?#6) Oxygen Pressure Indicator
- (near R?#32) 0-4V
- (near R?#30) 0-12V
- (near J?#9) Cabin Pressurezation Panel
- (near J?#8) Audio Control Panel_3
- (near R?#40) 0-12V
- (near R?#38) 0-12V
- (near J?#11) Audio Control Panel_1
- (near J?#10) Audio Control Panel_2
- Labels drawn without touching a wire or pin: OP-AMP, TLV2374
- Title
- Size:
- Date:
- A3
- Number:
- Time:
- Revision:
- Sheet
- of
- File:

### Library data of the parts
C?#20-C?#27 = C0805C333: Manufacturer Code: MC0805B333K500CT; Manufacturer: MULTICOMP; Voltage: 50V; Tolerace: ± 10%; Farnell Code: 1759257; Unit Price: 0,022 €; MOQ: 10; Package: 0805
J?#4-J?#11 = 2x Terminal: as J2 on sheet Sheet2; Value: 2x Terminal; Farnell Code: 1131855; Unit Price: 0,55 €
R?#17-R?#34 R?#37-R?#42 = 0805_1K: as R11#1 on sheet Sheet2; Farnell Code: 9332383; Unit Price: 0,03 €
R?#35 R?#36 = 0805_4K7%1: as R11#2 on sheet opto_input; Unit Price: 0,34; Farnell Code: 1506096; MOQ: 5
U?#3-U?#7 U?#9-U?#13 = TLV2374: Manufacturer Code: TLV2374ID; Manufacturer: Texas Instruments; Farnell Code: 8455040; Unit Price: 1,07 €; Value: TLV2374
U?#8 = AD5675ARUZ: Vendor: Analog Devices Inc; Built_By: Analog Devices Inc.; Value: AD5675ARUZ; Manufacturer_Part_Number: AD5675ARUZ

## Sheet Analog Inputs.SchDoc
size A4
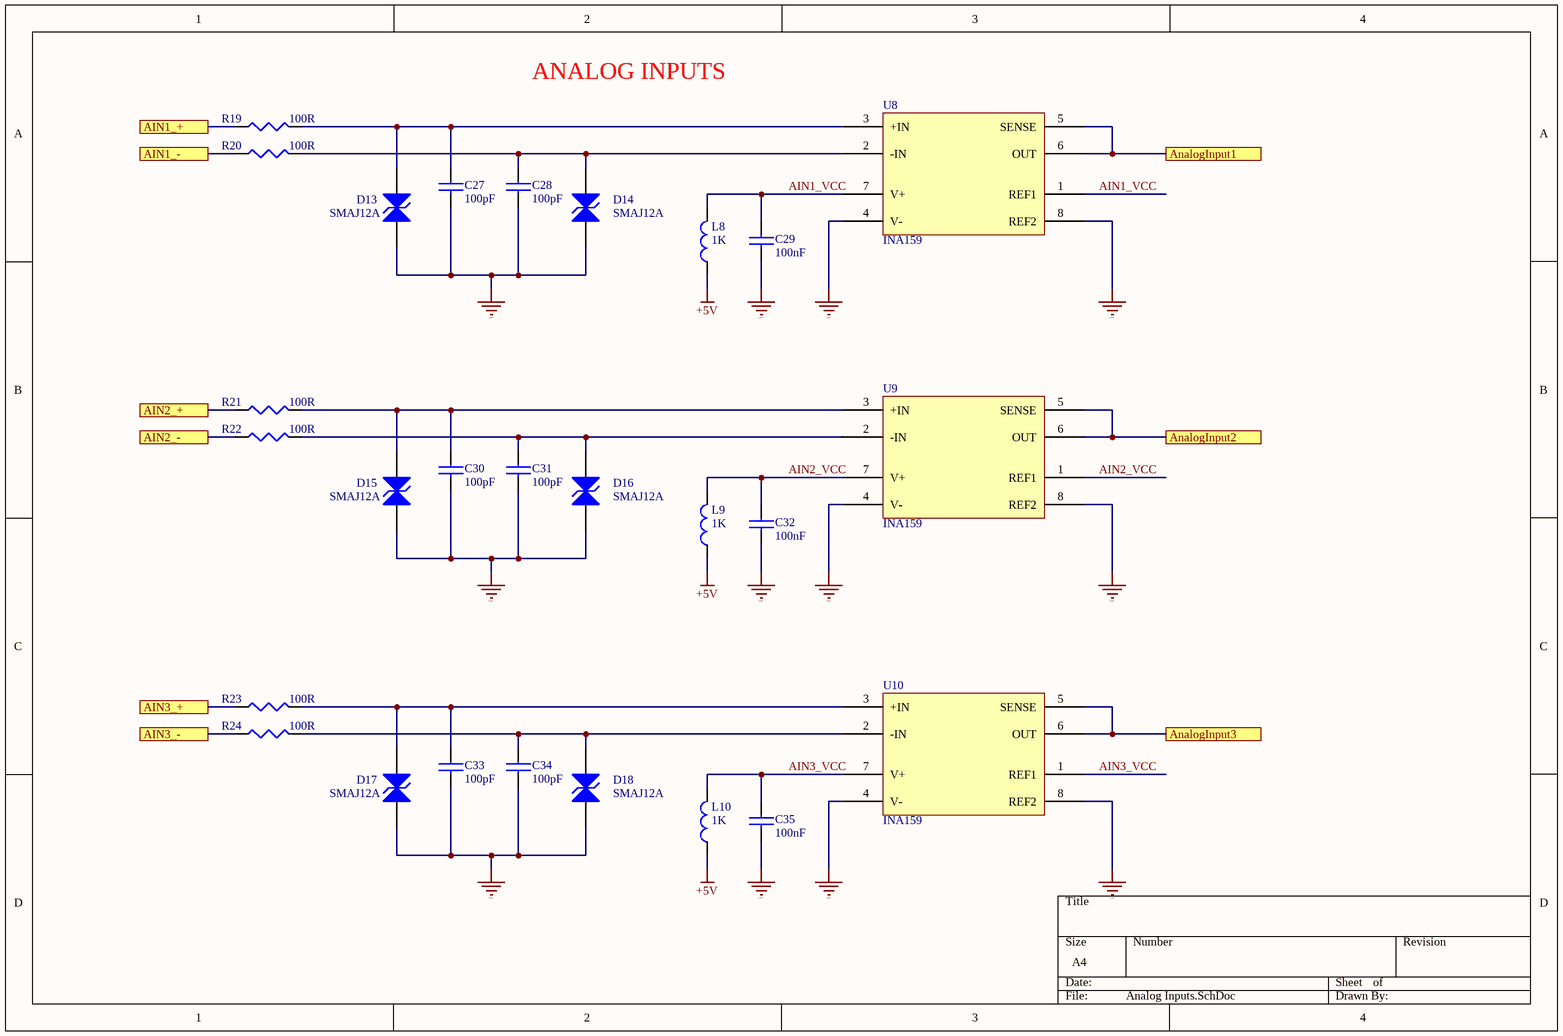
[diagram p5: Analog Inputs.SchDoc]

### Parts
(Parts that share a designator on the sheet are numbered #1, #2 ... from top to bottom, then left to right.)
C27  value 100pF  [0805 SMD Ceramic Capacitor]  (hidden comment: C0805C101)
C28  value 100pF  [0805 SMD Ceramic Capacitor]  (hidden comment: C0805C101)
C29  value 100nF  [0805 SMD Ceramic Capacitor]  (hidden comment: C0805C104)
C30  value 100pF  [0805 SMD Ceramic Capacitor]  (hidden comment: C0805C101)
C31  value 100pF  [0805 SMD Ceramic Capacitor]  (hidden comment: C0805C101)
C32  value 100nF  [0805 SMD Ceramic Capacitor]  (hidden comment: C0805C104)
C33  value 100pF  [0805 SMD Ceramic Capacitor]  (hidden comment: C0805C101)
C34  value 100pF  [0805 SMD Ceramic Capacitor]  (hidden comment: C0805C101)
C35  value 100nF  [0805 SMD Ceramic Capacitor]  (hidden comment: C0805C104)
D13  SMAJ12A  [SMA]
D14  SMAJ12A  [SMA]
D15  SMAJ12A  [SMA]
D16  SMAJ12A  [SMA]
D17  SMAJ12A  [SMA]
D18  SMAJ12A  [SMA]
L8  value 1K  [0805 Inductor]  (hidden comment: 0805Ferrite)
L9  value 1K  [0805 Inductor]  (hidden comment: 0805Ferrite)
L10  value 1K  [0805 Inductor]  (hidden comment: 0805Ferrite)
R19#2  value 100R  [0805 Resistor]  (hidden comment: 0805_100R%1)
R20#2  value 100R  [0805 Resistor]  (hidden comment: 0805_100R%1)
R21#2  value 100R  [0805 Resistor]  (hidden comment: 0805_100R%1)
R22#2  value 100R  [0805 Resistor]  (hidden comment: 0805_100R%1)
R23  value 100R  [0805 Resistor]  (hidden comment: 0805_100R%1)
R24  value 100R  [0805 Resistor]  (hidden comment: 0805_100R%1)
U8  INA159  [VSSOP8]
U9  INA159  [VSSOP8]
U10  INA159  [VSSOP8]

### Ports
AIN1_+, AIN1_-, AIN2_+, AIN2_-, AIN3_+, AIN3_-, AnalogInput1, AnalogInput2, AnalogInput3

### Nets
+5V: L8.1 L9.1 L10.1
GND: C27.2 C28.2 C29.2 C30.2 C31.2 C32.2 C33.2 C34.2 C35.2 D13.2(K) D14.2(K) D15.2(K) D16.2(K) D17.2(K) D18.2(K) U8.4(V-) U8.8(REF2) U9.4(V-) U9.8(REF2) U10.4(V-) U10.8(REF2)
AIN1_VCC: C29.1 L8.2 U8.1(REF1) U8.7(V+)
AIN2_VCC: C32.1 L9.2 U9.1(REF1) U9.7(V+)
AIN3_VCC: C35.1 L10.2 U10.1(REF1) U10.7(V+)
NetC27_1: C27.1 D13.1(A) R19#2.2 U8.3(+IN)
NetC28_1: C28.1 D14.1(A) R20#2.2 U8.2(-IN)
NetC30_1: C30.1 D15.1(A) R21#2.2 U9.3(+IN)
NetC31_1: C31.1 D16.1(A) R22#2.2 U9.2(-IN)
NetC33_1: C33.1 D17.1(A) R23.2 U10.3(+IN)
NetC34_1: C34.1 D18.1(A) R24.2 U10.2(-IN)
NetR19#2_1: R19#2.1 ; port AIN1_+
NetR20#2_1: R20#2.1 ; port AIN1_-
NetR21#2_1: R21#2.1 ; port AIN2_+
NetR22#2_1: R22#2.1 ; port AIN2_-
NetR23_1: R23.1 ; port AIN3_+
NetR24_1: R24.1 ; port AIN3_-
NetU8_5: U8.5(SENSE) U8.6(OUT) ; port AnalogInput1
NetU9_5: U9.5(SENSE) U9.6(OUT) ; port AnalogInput2
NetU10_5: U10.5(SENSE) U10.6(OUT) ; port AnalogInput3

### Notes on the sheet
- ANALOG INPUTS

### Library data of the parts
C27 C28 C30 C31 C33 C34 = C0805C101: as C23 on sheet opto_input; Unit Price: 0,33 $; Package: 0805
C29 C32 C35 = C0805C104: as C1 on sheet Sheet2; Farnell Code: 1414663; Unit Price: 0,06 €; Package: 0805
D13-D18 = SMAJ12A: Manufacturer Code: SMAJ12A-E3/61; Manufacturer: VISHAY Semiconductor; Voltage: 12V; Farnell Code: 1837044; Unit Price: 0,32 €; Value: SMAJ12A
L8-L10 = 0805Ferrite: as L1 on sheet Sheet2; Farnell Code: 1669719; Unit Price: 0,059 €
R19#2 R20#2 R21#2 R22#2 R23 R24 = 0805_100R%1: Manufacturer Code: MC 0.1W 0805 1% 100R; Manufacturer: MULTICOMP; Tolerance: ±1%; Farnell Code: 9332375; Unit Price: 0,03 €
U8-U10 = INA159: Manufacturer: Texas Instruments; Manufacturer Code: INA159AIDGKR; Unit Price: 4,08$; Value: INA159

## Sheet Serial and Ethernet.SchDoc
size A3; Organization: Altium Limited; Address1: L3, 12a Rodborough Rd; Address2: Frenchs Forest; Address3: NSW; Address4: Australia 2086
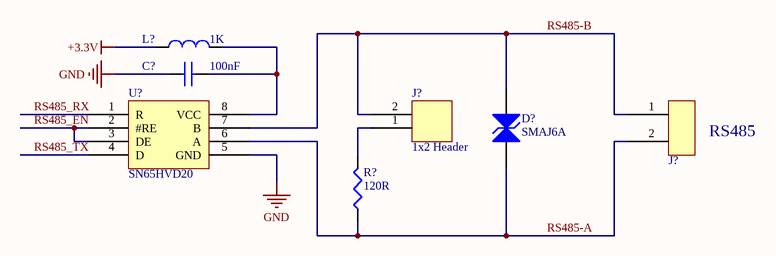
[diagram p6: Serial and Ethernet.SchDoc]

### Parts
(Parts that share a designator on the sheet are numbered #1, #2 ... from top to bottom, then left to right.)
C?#28  value 100nF  [0805 SMD Ceramic Capacitor]  (hidden comment: C0805C104)
D?#8  SMAJ6A  [SMA]
J?#12  2x Terminal  [2x Terminal mini]  (value not drawn)
J?#13  value 1x2 Header  [1x2 2 Pin Header]  (hidden comment: 1x2 2 Pin Header)
L?#7  value 1K  [0805 Inductor]  (hidden comment: 0805Ferrite)
R?#43  value 120R  [0805 Resistor]  (hidden comment: 0805_120R)
U?#14  SN65HVD20  [SO8]

### Nets
+3.3V: L?#7.1
GND: C?#28.1 U?#14.5(GND)
RS485-A: D?#8.1(A) J?#12.2 R?#43.1 U?#14.6(A)
RS485-B: D?#8.2(K) J?#12.1 J?#13.2 U?#14.7(B)
RS485_EN: U?#14.2(#RE) U?#14.3(DE)
RS485_RX: U?#14.1(R)
RS485_TX: U?#14.4(D)
NetC?#28_2: C?#28.2 L?#7.2 U?#14.8(VCC)
NetJ?#13_1: J?#13.1 R?#43.2

### Notes on the sheet
- (near J?#12) RS485
- Title
- Size:
- Date:
- A3
- Number:
- Time:
- Revision:
- Sheet
- of
- File:

### Library data of the parts
C?#28 = C0805C104: as C1 on sheet Sheet2; Farnell Code: 1414663; Unit Price: 0,06 €; Package: 0805
D?#8 = SMAJ6A: as D1 on sheet Sheet2; Farnell Code: 1579007; Unit Price: 0,24 €; Value: SMAJ6A
J?#12 = 2x Terminal: as J2 on sheet Sheet2; Value: 2x Terminal; Farnell Code: 1131855; Unit Price: 0,55 €
L?#7 = 0805Ferrite: as L1 on sheet Sheet2; Farnell Code: 1669719; Unit Price: 0,059 €
R?#43 = 0805_120R: as R3 on sheet Sheet2; Farnell Code: 9332480; Unit Price: 0,03 €
U?#14 = SN65HVD20: as U2 on sheet Sheet2; Unit Price: 3,56 €; Farnell Code: 1212361; Value: SN65HVD20

## Sheet Resistive_Load_Output.SchDoc
size A3; Organization: Altium Limited; Address1: L3, 12a Rodborough Rd; Address2: Frenchs Forest; Address3: NSW; Address4: Australia 2086
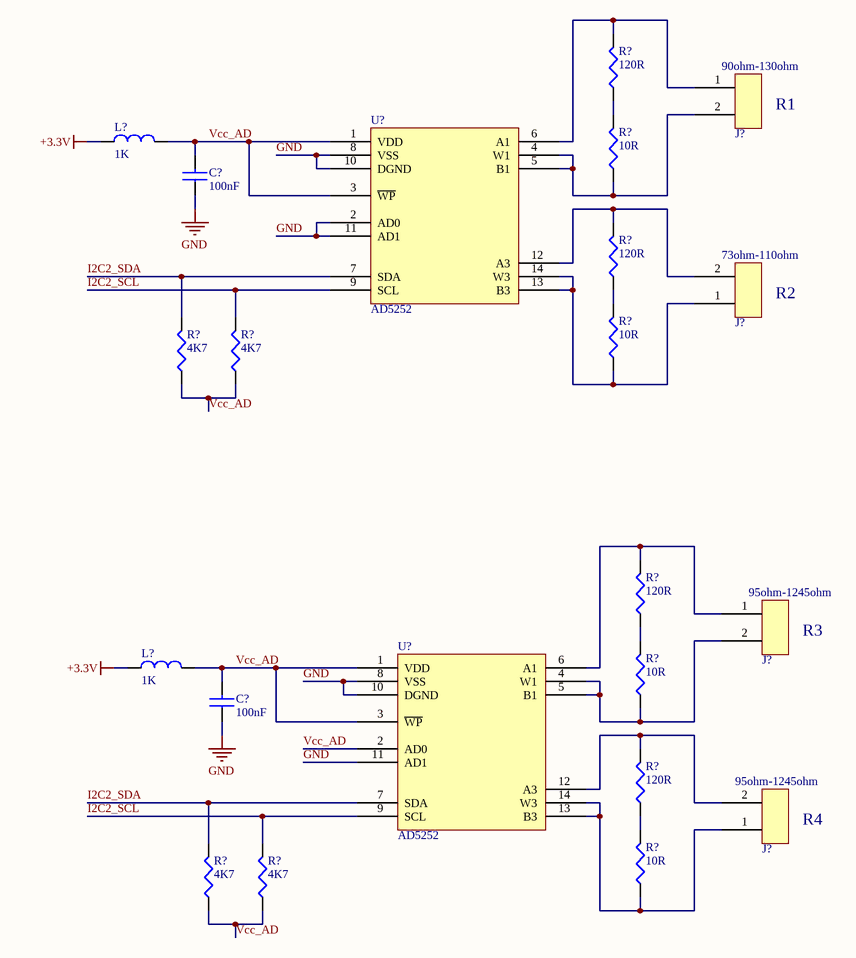
[diagram p7: Resistive_Load_Output.SchDoc]

### Parts
(Parts that share a designator on the sheet are numbered #1, #2 ... from top to bottom, then left to right.)
C?#29  value 100nF  [0805 SMD Ceramic Capacitor]  (hidden comment: C0805C104)
C?#30  value 100nF  [0805 SMD Ceramic Capacitor]  (hidden comment: C0805C104)
J?#14  2x Terminal  [2x Terminal mini]  (value not drawn)
J?#15  2x Terminal  [2x Terminal mini]  (value not drawn)
J?#16  2x Terminal  [2x Terminal mini]  (value not drawn)
J?#17  2x Terminal  [2x Terminal mini]  (value not drawn)
L?#8  value 1K  [0805 Inductor]  (hidden comment: 0805Ferrite)
L?#9  value 1K  [0805 Inductor]  (hidden comment: 0805Ferrite)
R?#44  value 120R  [0805 Resistor]  (hidden comment: 0805_120R)
R?#45  value 10R  [0805 Resistor]  (hidden comment: 0805_10R)
R?#46  value 120R  [0805 Resistor]  (hidden comment: 0805_120R)
R?#47  value 10R  [0805 Resistor]  (hidden comment: 0805_10R)
R?#48  value 4K7  [0805 Resistor]  (hidden comment: 0805_4K7%1)
R?#49  value 4K7  [0805 Resistor]  (hidden comment: 0805_4K7%1)
R?#50  value 120R  [0805 Resistor]  (hidden comment: 0805_120R)
R?#51  value 10R  [0805 Resistor]  (hidden comment: 0805_10R)
R?#52  value 120R  [0805 Resistor]  (hidden comment: 0805_120R)
R?#53  value 10R  [0805 Resistor]  (hidden comment: 0805_10R)
R?#54  value 4K7  [0805 Resistor]  (hidden comment: 0805_4K7%1)
R?#55  value 4K7  [0805 Resistor]  (hidden comment: 0805_4K7%1)
U?#15  value AD5252  [TSSOP14]  (hidden comment: U)
U?#16  value AD5252  [TSSOP14]  (hidden comment: U)

### Nets
+3.3V: L?#8.1 L?#9.1
GND: C?#29.1 C?#30.1 U?#15.2(AD0) U?#15.8(VSS) U?#15.10(DGND) U?#15.11(AD1) U?#16.8(VSS) U?#16.10(DGND) U?#16.11(AD1)
I2C2_SCL: R?#49.2 R?#55.2 U?#15.9(SCL) U?#16.9(SCL)
I2C2_SDA: R?#48.2 R?#54.2 U?#15.7(SDA) U?#16.7(SDA)
Vcc_AD: C?#29.2 C?#30.2 L?#8.2 L?#9.2 R?#48.1 R?#49.1 R?#54.1 R?#55.1 U?#15.1(VDD) U?#15.3(~{WP}) U?#16.1(VDD) U?#16.2(AD0) U?#16.3(~{WP})
NetJ?#14_1: J?#14.1 R?#44.2 U?#15.6(A1)
NetJ?#14_2: J?#14.2 R?#45.1 U?#15.4(W1) U?#15.5(B1)
NetJ?#15_1: J?#15.1 R?#47.1 U?#15.13(B3) U?#15.14(W3)
NetJ?#15_2: J?#15.2 R?#46.2 U?#15.12(A3)
NetJ?#16_1: J?#16.1 R?#50.2 U?#16.6(A1)
NetJ?#16_2: J?#16.2 R?#51.1 U?#16.4(W1) U?#16.5(B1)
NetJ?#17_1: J?#17.1 R?#53.1 U?#16.13(B3) U?#16.14(W3)
NetJ?#17_2: J?#17.2 R?#52.2 U?#16.12(A3)
NetR?#44_1: R?#44.1 R?#45.2
NetR?#46_1: R?#46.1 R?#47.2
NetR?#50_1: R?#50.1 R?#51.2
NetR?#52_1: R?#52.1 R?#53.2

### Notes on the sheet
- (near J?#14) 90ohm-130ohm
- (near J?#14) R1
- (near J?#15) 73ohm-110ohm
- (near J?#15) R2
- (near J?#16) 95ohm-1245ohm
- (near J?#16) R3
- (near J?#17) 95ohm-1245ohm
- (near J?#17) R4
- Title
- Size:
- Date:
- A3
- Number:
- Time:
- Revision:
- Sheet
- of
- File:

### Library data of the parts
C?#29 C?#30 = C0805C104: as C1 on sheet Sheet2; Farnell Code: 1414663; Unit Price: 0,06 €; Package: 0805
J?#14-J?#17 = 2x Terminal: as J2 on sheet Sheet2; Value: 2x Terminal; Farnell Code: 1131855; Unit Price: 0,55 €
L?#8 L?#9 = 0805Ferrite: as L1 on sheet Sheet2; Farnell Code: 1669719; Unit Price: 0,059 €
R?#44 R?#46 R?#50 R?#52 = 0805_120R: as R3 on sheet Sheet2; Farnell Code: 9332480; Unit Price: 0,03 €
R?#45 R?#47 R?#51 R?#53 = 0805_10R: Manufacturer Code: CRCW080510R0FKEA; Manufacturer: VISHAY DRALORIC; Tolerance: ±1%; Farnell Code: 1469859; Unit Price: 0,017 €
R?#48 R?#49 R?#54 R?#55 = 0805_4K7%1: as R11#2 on sheet opto_input; Unit Price: 0,34; Farnell Code: 1506096; MOQ: 5
U?#15 U?#16 = AD5252: Manufacturer Code: AD5252BRUZ1; Manufacturer: Analog Devices Inc.; Unit Price: 4,26$